# Altium project CT9042.PrjPcb (part 2 of 2)

## Sheet MULTIPLIER.SchDoc
size Tabloid; SheetNumber: 7; SheetTotal: 9
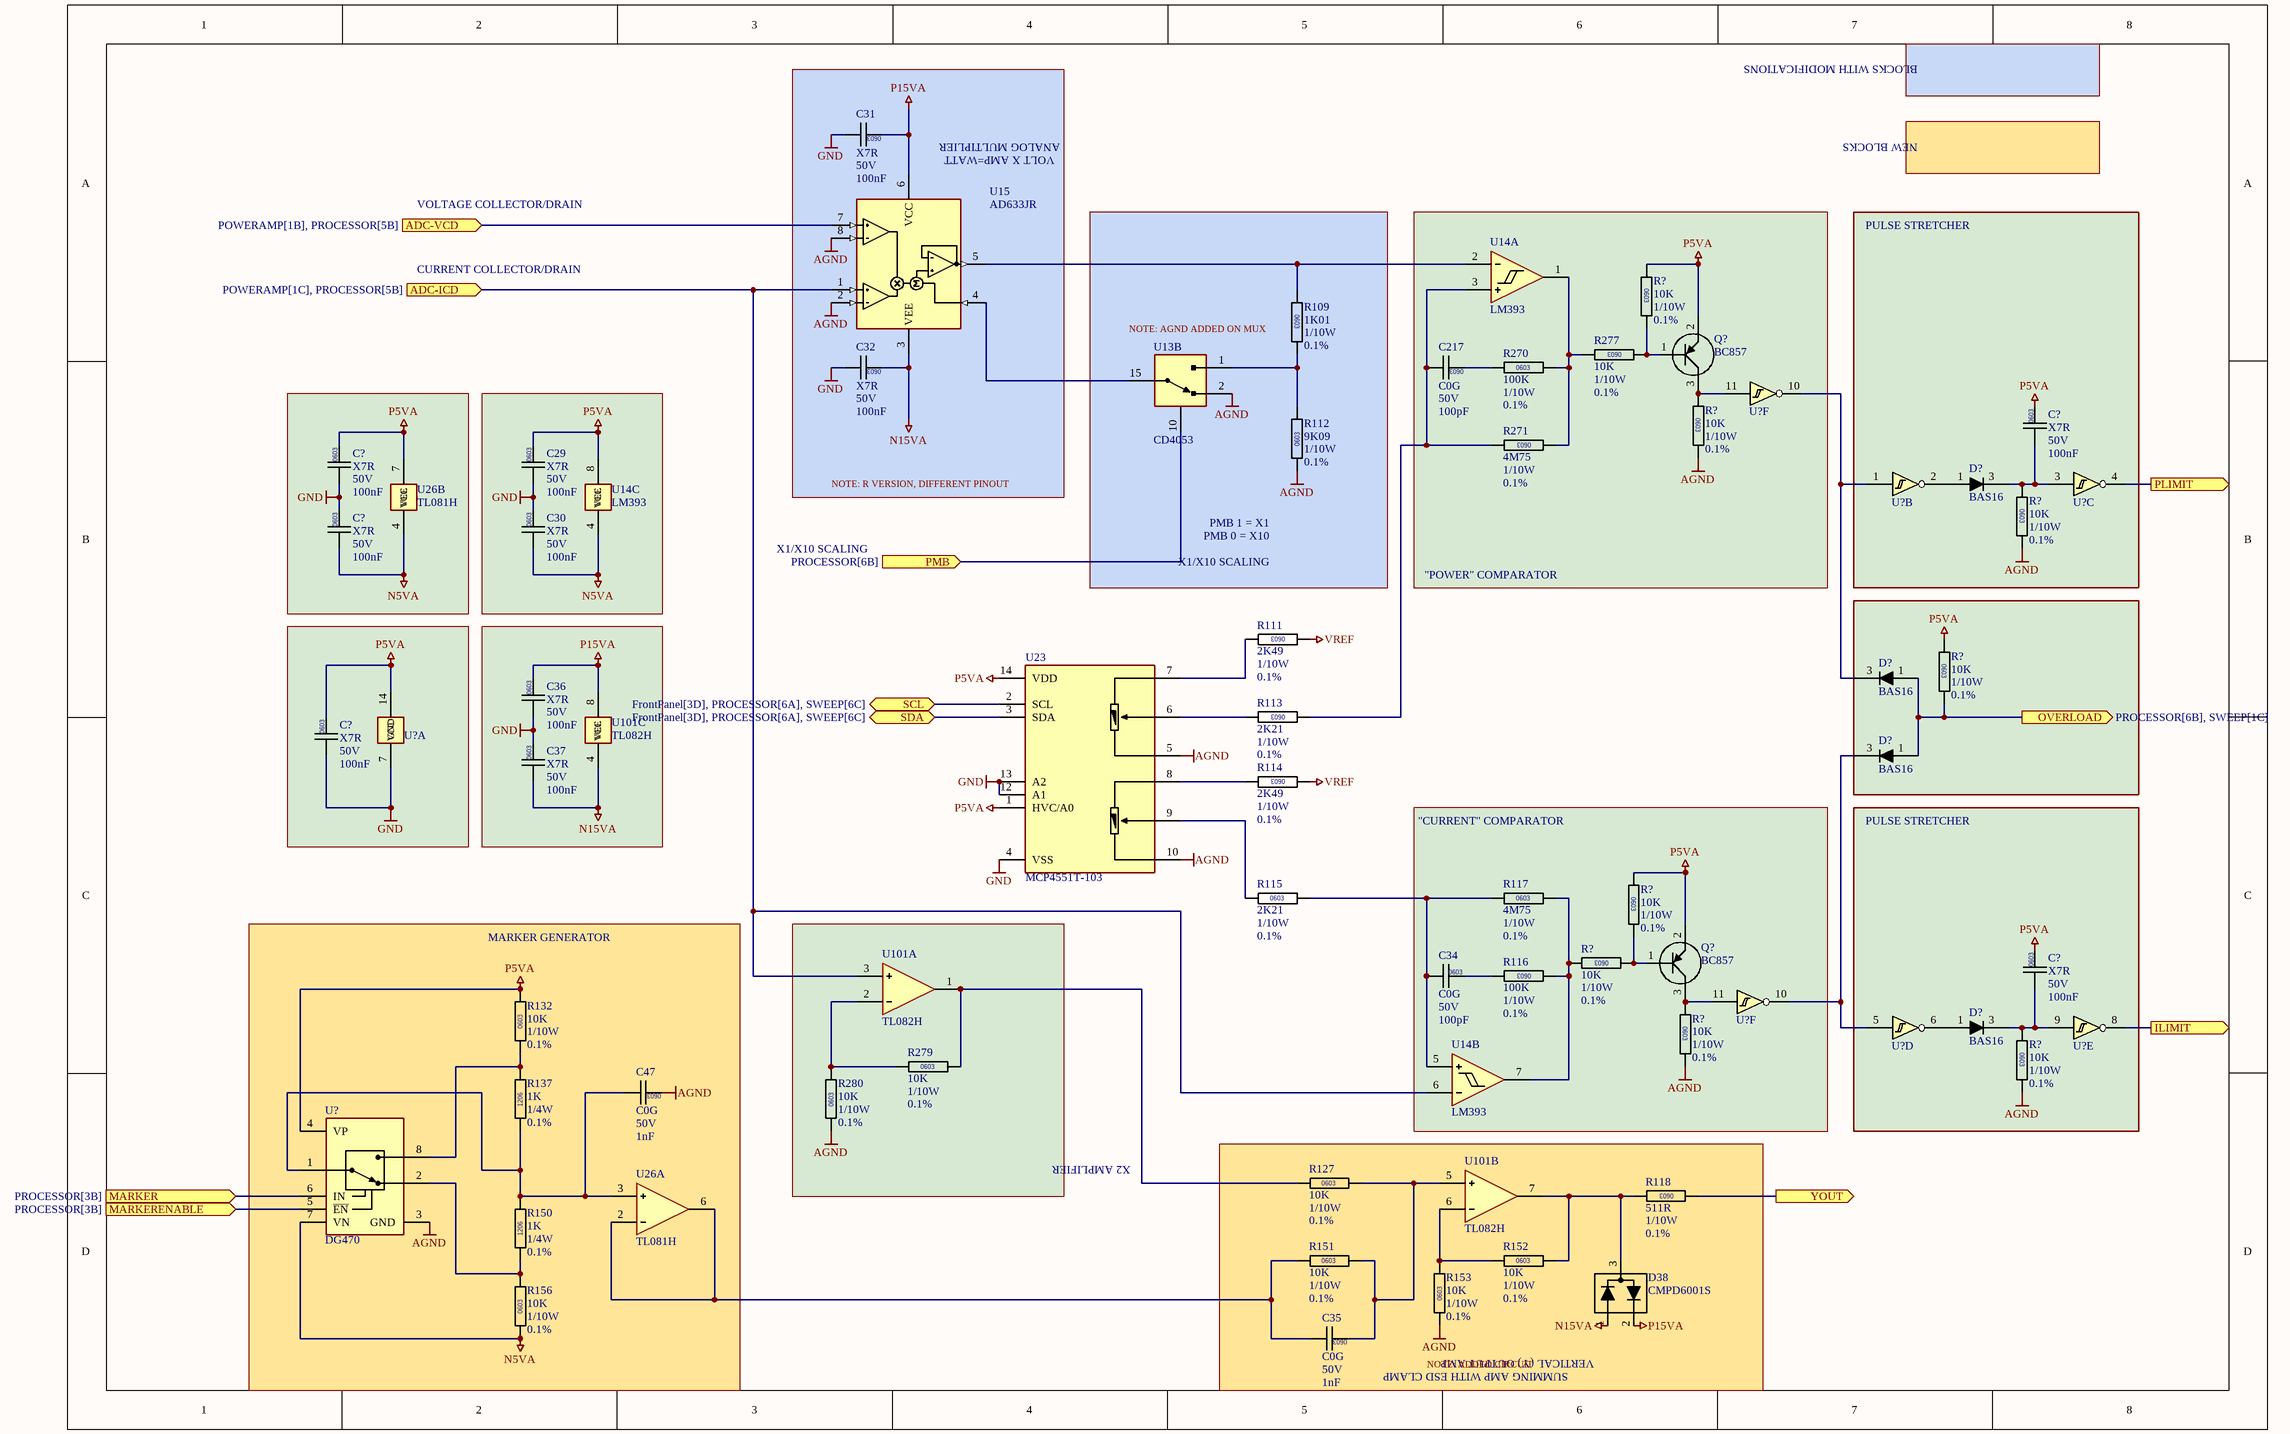
[diagram p5: MULTIPLIER.SchDoc]

### Parts
(Parts that share a designator on the sheet are numbered #1, #2 ... from top to bottom, then left to right.)
C29  Dielectric: X7R  Voltage: 50V  Capacitance: 100nF  [CAPC0603]  (hidden comment: CAP0603)
C30  Dielectric: X7R  Voltage: 50V  Capacitance: 100nF  [CAPC0603]  (hidden comment: CAP0603)
C31  Dielectric: X7R  Voltage: 50V  Capacitance: 100nF  [CAPC0603]  (hidden comment: CAP0603)
C32  Dielectric: X7R  Voltage: 50V  Capacitance: 100nF  [CAPC0603]  (hidden comment: CAP0603)
C34  Dielectric: C0G  Voltage: 50V  Capacitance: 100pF  [CAPC0603]  (hidden comment: CAP0603)
C35  Dielectric: C0G  Voltage: 50V  Capacitance: 1nF  [CAPC0603]  (hidden comment: CAP0603)
C36  Dielectric: X7R  Voltage: 50V  Capacitance: 100nF  [CAPC0603]  (hidden comment: CAP0603)
C37  Dielectric: X7R  Voltage: 50V  Capacitance: 100nF  [CAPC0603]  (hidden comment: CAP0603)
C47  Dielectric: C0G  Voltage: 50V  Capacitance: 1nF  [CAPC0603]  (hidden comment: CAP0603)
C217  Dielectric: C0G  Voltage: 50V  Capacitance: 100pF  [CAPC0603]  (hidden comment: CAP0603)
C?#1  Dielectric: X7R  Voltage: 50V  Capacitance: 100nF  [CAPC0603]  (hidden comment: CAP0603)
C?#2  Dielectric: X7R  Voltage: 50V  Capacitance: 100nF  [CAPC0603]  (hidden comment: CAP0603)
C?#3  Dielectric: X7R  Voltage: 50V  Capacitance: 100nF  [CAPC0603]  (hidden comment: CAP0603)
C?#4  Dielectric: X7R  Voltage: 50V  Capacitance: 100nF  [CAPC0603]  (hidden comment: CAP0603)
C?#5  Dielectric: X7R  Voltage: 50V  Capacitance: 100nF  [CAPC0603]  (hidden comment: CAP0603)
D38  CMPD6001S  [SOT23]
D?#1  BAS16  [SOT23]
D?#2  BAS16  [SOT23]
D?#3  BAS16  [SOT23]
D?#4  BAS16  [SOT23]
Q?#1  BC857  [SOT23]
Q?#2  BC857  [SOT23]
R109  value 1K01  Power: 1/10W  Tolerance: 0.1%  [RESC0603]  (hidden comment: RESC0603)
R111  value 2K49  Power: 1/10W  Tolerance: 0.1%  [RESC0603]  (hidden comment: RESC0603)
R112  value 9K09  Power: 1/10W  Tolerance: 0.1%  [RESC0603]  (hidden comment: RESC0603)
R113  value 2K21  Power: 1/10W  Tolerance: 0.1%  [RESC0603]  (hidden comment: RESC0603)
R114  value 2K49  Power: 1/10W  Tolerance: 0.1%  [RESC0603]  (hidden comment: RESC0603)
R115  value 2K21  Power: 1/10W  Tolerance: 0.1%  [RESC0603]  (hidden comment: RESC0603)
R116  value 100K  Power: 1/10W  Tolerance: 0.1%  [RESC0603]  (hidden comment: RESC0603)
R117  value 4M75  Power: 1/10W  Tolerance: 0.1%  [RESC0603]  (hidden comment: RESC0603)
R118  value 511R  Power: 1/10W  Tolerance: 0.1%  [RESC0603]  (hidden comment: RESC0603)
R127  value 10K  Power: 1/10W  Tolerance: 0.1%  [RESC0603]  (hidden comment: RESC0603)
R132  value 10K  Power: 1/10W  Tolerance: 0.1%  [RESC0603]  (hidden comment: RESC0603)
R137  value 1K  Power: 1/4W  Tolerance: 0.1%  [RESC1206]  (hidden comment: RESC1206)
R150  value 1K  Power: 1/4W  Tolerance: 0.1%  [RESC1206]  (hidden comment: RESC1206)
R151  value 10K  Power: 1/10W  Tolerance: 0.1%  [RESC0603]  (hidden comment: RESC0603)
R152  value 10K  Power: 1/10W  Tolerance: 0.1%  [RESC0603]  (hidden comment: RESC0603)
R153  value 10K  Power: 1/10W  Tolerance: 0.1%  [RESC0603]  (hidden comment: RESC0603)
R156  value 10K  Power: 1/10W  Tolerance: 0.1%  [RESC0603]  (hidden comment: RESC0603)
R270  value 100K  Power: 1/10W  Tolerance: 0.1%  [RESC0603]  (hidden comment: RESC0603)
R271  value 4M75  Power: 1/10W  Tolerance: 0.1%  [RESC0603]  (hidden comment: RESC0603)
R277  value 10K  Power: 1/10W  Tolerance: 0.1%  [RESC0603]  (hidden comment: RESC0603)
R279  value 10K  Power: 1/10W  Tolerance: 0.1%  [RESC0603]  (hidden comment: RESC0603)
R280  value 10K  Power: 1/10W  Tolerance: 0.1%  [RESC0603]  (hidden comment: RESC0603)
R?#1  value 10K  Power: 1/10W  Tolerance: 0.1%  [RESC0603]  (hidden comment: RESC0603)
R?#2  value 10K  Power: 1/10W  Tolerance: 0.1%  [RESC0603]  (hidden comment: RESC0603)
R?#3  value 10K  Power: 1/10W  Tolerance: 0.1%  [RESC0603]  (hidden comment: RESC0603)
R?#4  value 10K  Power: 1/10W  Tolerance: 0.1%  [RESC0603]  (hidden comment: RESC0603)
R?#5  value 10K  Power: 1/10W  Tolerance: 0.1%  [RESC0603]  (hidden comment: RESC0603)
R?#6  value 10K  Power: 1/10W  Tolerance: 0.1%  [RESC0603]  (hidden comment: RESC0603)
R?#7  value 10K  Power: 1/10W  Tolerance: 0.1%  [RESC0603]  (hidden comment: RESC0603)
R?#8  value 10K  Power: 1/10W  Tolerance: 0.1%  [RESC0603]  (hidden comment: RESC0603)
U13  CD4053  [SO127P600-16N]  (part B of 4)
U14  LM393  [SO127P600-8N]  (parts A,B,C of 3)
U15  AD633JR  [SO127P600-8N]
U23  MCP4551T-103
U26  TL081H  [SO127P600-8N]  (parts A,B of 2)
U101  TL082H  [SO127P600-8N]  (parts A,B,C of 3)
U?#1  CD40106  (value not drawn)  (part F of 7)
U?#2  CD40106  (value not drawn)  (part B of 7)
U?#3  CD40106  (value not drawn)  (part C of 7)
U?#4  CD40106  (value not drawn)  (part A of 7)
U?#5  CD40106  (value not drawn)  (part F of 7)
U?#6  CD40106  (value not drawn)  (part D of 7)
U?#7  CD40106  (value not drawn)  (part E of 7)
U?#8  DG470  [SO127P600-8N]

### Blocks framed on the sheet
"POWER" COMPARATOR: C217 Q?#1 R270 R271 R277 R?#1 R?#2 U14 U?#1
PULSE STRETCHER: C?#1 D?#1 R?#3 U?#2 U?#3
"CURRENT" COMPARATOR: C34 Q?#2 R116 R117 R?#5-R?#7 U14 U?#5
PULSE STRETCHER: C?#5 D?#4 R?#8 U?#6 U?#7
MARKER GENERATOR: C47 R132 R137 R150 R156 U26 U?#8
X2 AMPLIFIER: R279 R280 U101

### Ports
ADC-ICD (in, see POWERAMP[1C], PROCESSOR[5B]), ADC-VCD (in, see POWERAMP[1B], PROCESSOR[5B]), ILIMIT (out), MARKER (in, see PROCESSOR[3B]), MARKERENABLE (in, see PROCESSOR[3B]), OVERLOAD (out, see PROCESSOR[6B], SWEEP[1C]), PLIMIT (out), PMB (in, see PROCESSOR[6B]), SCL (bidir, see FrontPanel[3D], PROCESSOR[6A], SWEEP[6C]), SDA (bidir, see FrontPanel[3D], PROCESSOR[6A], SWEEP[6C]), YOUT (out)

### Nets
AGND: C47.1 R112.2 R153.2 R280.2 R?#2.1 R?#3.1 R?#7.1 R?#8.1 U13.2(Y2) U15.2(YN) U15.8(X1N) U23.5(POA) U23.10(POB) U?#8.3(GND)
GND: C29.2 C30.1 C31.2 C32.2 C36.2 C37.1 C?#2.2 C?#3.1 C?#4.2 U23.4(VSS) U23.12(A1) U23.13(A2) U?#4.7(GND)
N5VA: C30.2 C?#3.2 R156.2 U14.4(VEE) U26.4(VEE) U?#8.7(VN)
N15VA: C32.1 C37.2 D38.1(K) U15.3(VEE) U101.4(VEE)
P5VA: C29.1 C?#1.1 C?#2.1 C?#4.1 C?#5.1 Q?#1.2(E) Q?#2.2(E) R132.1 R?#1.2 R?#4.2 R?#5.2 U14.8(VCC) U23.1(HVC/A0) U23.14(VDD) U26.7(VCC) U?#4.14(VCC) U?#8.4(VP)
P15VA: C31.1 C36.1 D38.2(A) U15.6(VCC) U101.8(VCC)
VREF: R111.2 R114.2
ADC-ICD: U14.6(-) U15.1(YP) U101.3(+) ; port ADC-ICD
ADC-VCD: U15.7(X1P) ; port ADC-VCD
ILIMIT: U?#7.8 ; port ILIMIT
MARKER: U?#8.6(IN) ; port MARKER
MARKERENABLE: U?#8.5(~{EN}) ; port MARKERENABLE
OVERLOAD: D?#2.1(A) D?#3.1(A) R?#4.1 ; port OVERLOAD
PLIMIT: U?#3.4 ; port PLIMIT
PMB: U13.10(A) ; port PMB
SCL: U23.2(SCL) ; port SCL
SDA: U23.3(SDA) ; port SDA
YOUT: R118.2 ; port YOUT
NetC34_1: C34.1 R116.2
NetC34_2: C34.2 R115.1 R117.2 U14.5(+)
NetC35_1: C35.1 R127.1 R151.1 U101.5(+)
NetC35_2: C35.2 R151.2 U26.2(-) U26.6(O)
NetC47_2: C47.2 R137.2 R150.1 U26.3(+) U?#8.1(COM)
NetC217_1: C217.1 R270.2
NetC217_2: C217.2 R113.2 R271.2 U14.3(+)
NetC?#1_2: C?#1.2 D?#1.3(K) R?#3.2 U?#3.3
NetC?#5_2: C?#5.2 D?#4.3(K) R?#8.2 U?#7.9
NetD38_3: D38.3(A) R118.1 R152.1 U101.7(O)
NetD?#1_1: D?#1.1(A) U?#2.2
NetD?#2_3: D?#2.3(K) U?#1.10 U?#2.1
NetD?#3_3: D?#3.3(K) U?#5.10 U?#6.5
NetD?#4_1: D?#4.1(A) U?#6.6
NetQ?#1_1: Q?#1.1(B) R277.2 R?#1.1
NetQ?#1_3: Q?#1.3(C) R?#2.2 U?#1.11
NetQ?#2_1: Q?#2.1(B) R?#5.1 R?#6.2
NetQ?#2_3: Q?#2.3(C) R?#7.2 U?#5.11
NetR109_1: R109.1 R112.1 U13.1(Y0)
NetR109_2: R109.2 U14.2(-) U15.5(W)
NetR111_1: R111.1 U23.7(POB)
NetR113_1: R113.1 U23.6(OW)
NetR114_1: R114.1 U23.8(POA)
NetR115_2: R115.2 U23.9(OW)
NetR116_1: R116.1 R117.1 R?#6.1 U14.7(O)
NetR127_2: R127.2 R279.1 U101.1(O)
NetR132_2: R132.2 R137.1 U?#8.8(NO)
NetR150_2: R150.2 R156.1 U?#8.2(COM)
NetR152_2: R152.2 R153.1 U101.6(-)
NetR270_1: R270.1 R271.1 R277.1 U14.1(O)
NetR279_2: R279.2 R280.1 U101.2(-)
NetU13_15: U13.15(X2) U15.4(Z)

### Notes on the sheet
- BLOCKS WITH MODIFICATIONS
- (near U15) ANALOG MULTIPLIER
- (near U15) VOLT X AMP=WATT
- NEW BLOCKS
- VOLTAGE COLLECTOR/DRAIN
- CURRENT COLLECTOR/DRAIN
- (near U13) NOTE: AGND ADDED ON MUX
- NOTE: R VERSION, DIFFERENT PINOUT
- X1/X10 SCALING
- PMB 0 = X10
- PMB 1 = X1
- (near R153) NOTE: ADDED CIRCUIT
- SUMMING AMP WITH ESD CLAMP
- (near D38) VERTICAL (Y) OUTPUT AMP
- (in symbol RESC-0603-1K01-0.1%-1/10W) 0603
- (in symbol RESC-0603-2K21-0.1%-1/10W) 0603
- (in symbol RESC-0603-2K49-0.1%-1/10W) 0603
- (in symbol RESC-0603-4M75-1%-1/10W) 0603
- (in symbol RESC-0603-9K09-0.1%-1/10W) 0603
- (in symbol RESC-0603-10K-0.1%-1/10W) 0603
- (in symbol RESC-0603-100K-0.1%-1/10W) 0603
- (in symbol RESC-0603-511R-0.1%) 0603
- (in symbol RESC-1206-1K-0.1%-1/4W) 1206

### Library data of the parts
C29-C32 C36 C37 C?#1-C?#5 = CAPC-0603-100nF-50V-X7R: CAPACITOR,CERAMIC,100nF,50V,X7R,0603; Manufacturer 1: KEMET; Manufacturer Part Number 1: C0603C104K5RACTU; Package / Case: 0603; Location: *; Supplier 1: Mouser; Supplier Part Number 1: 80-C0603C104K5R7867; Supplier 2: Mouser; Supplier Part Number 2: 80-C0603C104K5R7411; Supplier 3: Avnet; Supplier Part Number 3: KGM15BR71H104KT; Supplier 4: Digikey; Supplier Part Number 4: 1276-1000-1-ND; LCSC: C127833; MOUSER: 80-C0603C104K5R
C34 C217 = CAPC-0603-100pF-50V-C0G: CAPACITOR,CERAMIC,100pF,50V,C0G,0603; Package / Case: 0603; Location: *
C35 C47 = CAPC-0603-1nF-20V-C0G: CAPACITOR,CERAMIC,1nF,50V,C0G,0603; Package / Case: 0603; Location: *
D38 = DIODE-CENTRALSEMI-CMPD6001S: DIODE,75V,250mA,SOT23,500pA ULTRA LOW LEAKAGE; Manufacturer 1: CENTRAL SEMICONDUCTOR; Manufacturer Part Number 1: CMPD6001S
D?#1-D?#4 = DIODE-RECTIFIER-DIODES-BAS16-SOT23: DIODE,RECTIFIER,75V,0.3A,BAS16,SOT23; Manufacturer 1: ONSEMI; Manufacturer Part Number 1: BAS16LT1G; DIGIKEY: BAS16LT1GOSCT-ND
Q?#1 Q?#2 = XSTR-PNP-BC857: XSTR,PNP,SOT23,BC857,SOT23; Manufacturer 1: NEXPERIA; Manufacturer Part Number 1: BC857BW,115; DIGIKEY: 1727-4869-1-ND
R109 = RESC-0603-1K01-0.1%-1/10W: RESISTOR,1K01,0.1%,100mW,0603 (1608); Location: *
R111 R114 = RESC-0603-2K49-0.1%-1/10W: RESISTOR,2K49,0.1%,100mW,0603 (1608); Location: *
R112 = RESC-0603-9K09-0.1%-1/10W: RESISTOR,9K09,0.1%,100mW,0603 (1608); Location: *
R113 R115 = RESC-0603-2K21-0.1%-1/10W: RESISTOR,2K21,0.1%,100mW,0603 (1608); Location: *
R116 R270 = RESC-0603-100K-0.1%-1/10W: RESISTOR,100K,0.1%,100mW,0603 (1608); Location: *
R117 R271 = RESC-0603-4M75-1%-1/10W: RESISTOR,4M75,0.1%,100mW,0603 (1608); Location: *
R118 = RESC-0603-511R-0.1%: RESISTOR,511R,0.1%,100mW,0603 (1608); Location: *
R127 R132 R151-R153 R156 R277 R279 R280 R?#1-R?#8 = RESC-0603-10K-0.1%-1/10W: RESISTOR,10K,0.1%,100mW,0603 (1608); Location: *
R137 R150 = RESC-1206-1K-0.1%-1/4W: RESISTOR,1K,1206,0.1%,125mW,1206; Location: *; Parameter 4: *
U13 = IC-TI-CD4053-SPLIT: IC,LOGIC,CMOS,4XXX,TRIPLE 2:1 MUX,SPLIT BLOCKS
U14 = IC-TI-LM393-SO8: IC,COMPARATOR,DUAL,LM393,SO8; Manufacturer 1: DIODES-INC; Manufacturer Part Number 1: AS393AMTR-E1; DIGIKEY: AS393AMTR-E1
U15 = IC-ANALOG-AD633XR-SO8: IC,ANALOG,MULTIPLIER,ANALOGDEVICES,AD633JRZ,SO8; DIGIKEY: 505-AD633JRZ-ND; Manufacturer 1: ANALOG DEVICES; Manufacturer Part Number 1: AD633JRZ
U23 = IC-MICROCHIP-MCP4651T-103: IC,DIGITAL POTMETER,257STEP,I2C,10K,MICROCHIP,MCP4551T-103
U26 = IC-TI-TL081-SO8: IC,OPAMP JFET,SINGLE,TL081HIDR,SO8; Manufacturer 1: TI; Manufacturer Part Number 1: TL081HIDR; MOUSER: 595-TL081HIDR
U101 = IC-TI-TL082H-SO8: IC,OPAMP JFET,DUAL,TL082HIDR,SO8; Manufacturer 1: TI; Manufacturer Part Number 1: TL082HIDR; MOUSER: 595-TL082HIDR
U?#1-U?#7 = IC-TI-CD40106-SO14: IC,LOGIC,CMOS.4XXX,HEX SCHMITTTRIGGER,CD40106,SO14; Manufacturer 1: ONSEMI; Manufacturer Part Number 1: MC74AC14DR2G; DIGIKEY: MC74AC14DR2GOSCT-ND
U?#8 = IC-SILICONIX-DG470EY-T1-E3-SO8: IC,ANALOG,SPDT ANALOG SWITCH,SILICONIX,DG470EY-T1-E3,SO8; Manufacturer 1: VSHIAY; DIGIKEY: DG470EY-T1-E3CT-ND; Manufacturer Part Number 1: DG470EY-T1-E3

## Sheet POWERMUX.SchDoc
size Tabloid; SheetNumber: 8; SheetTotal: 9
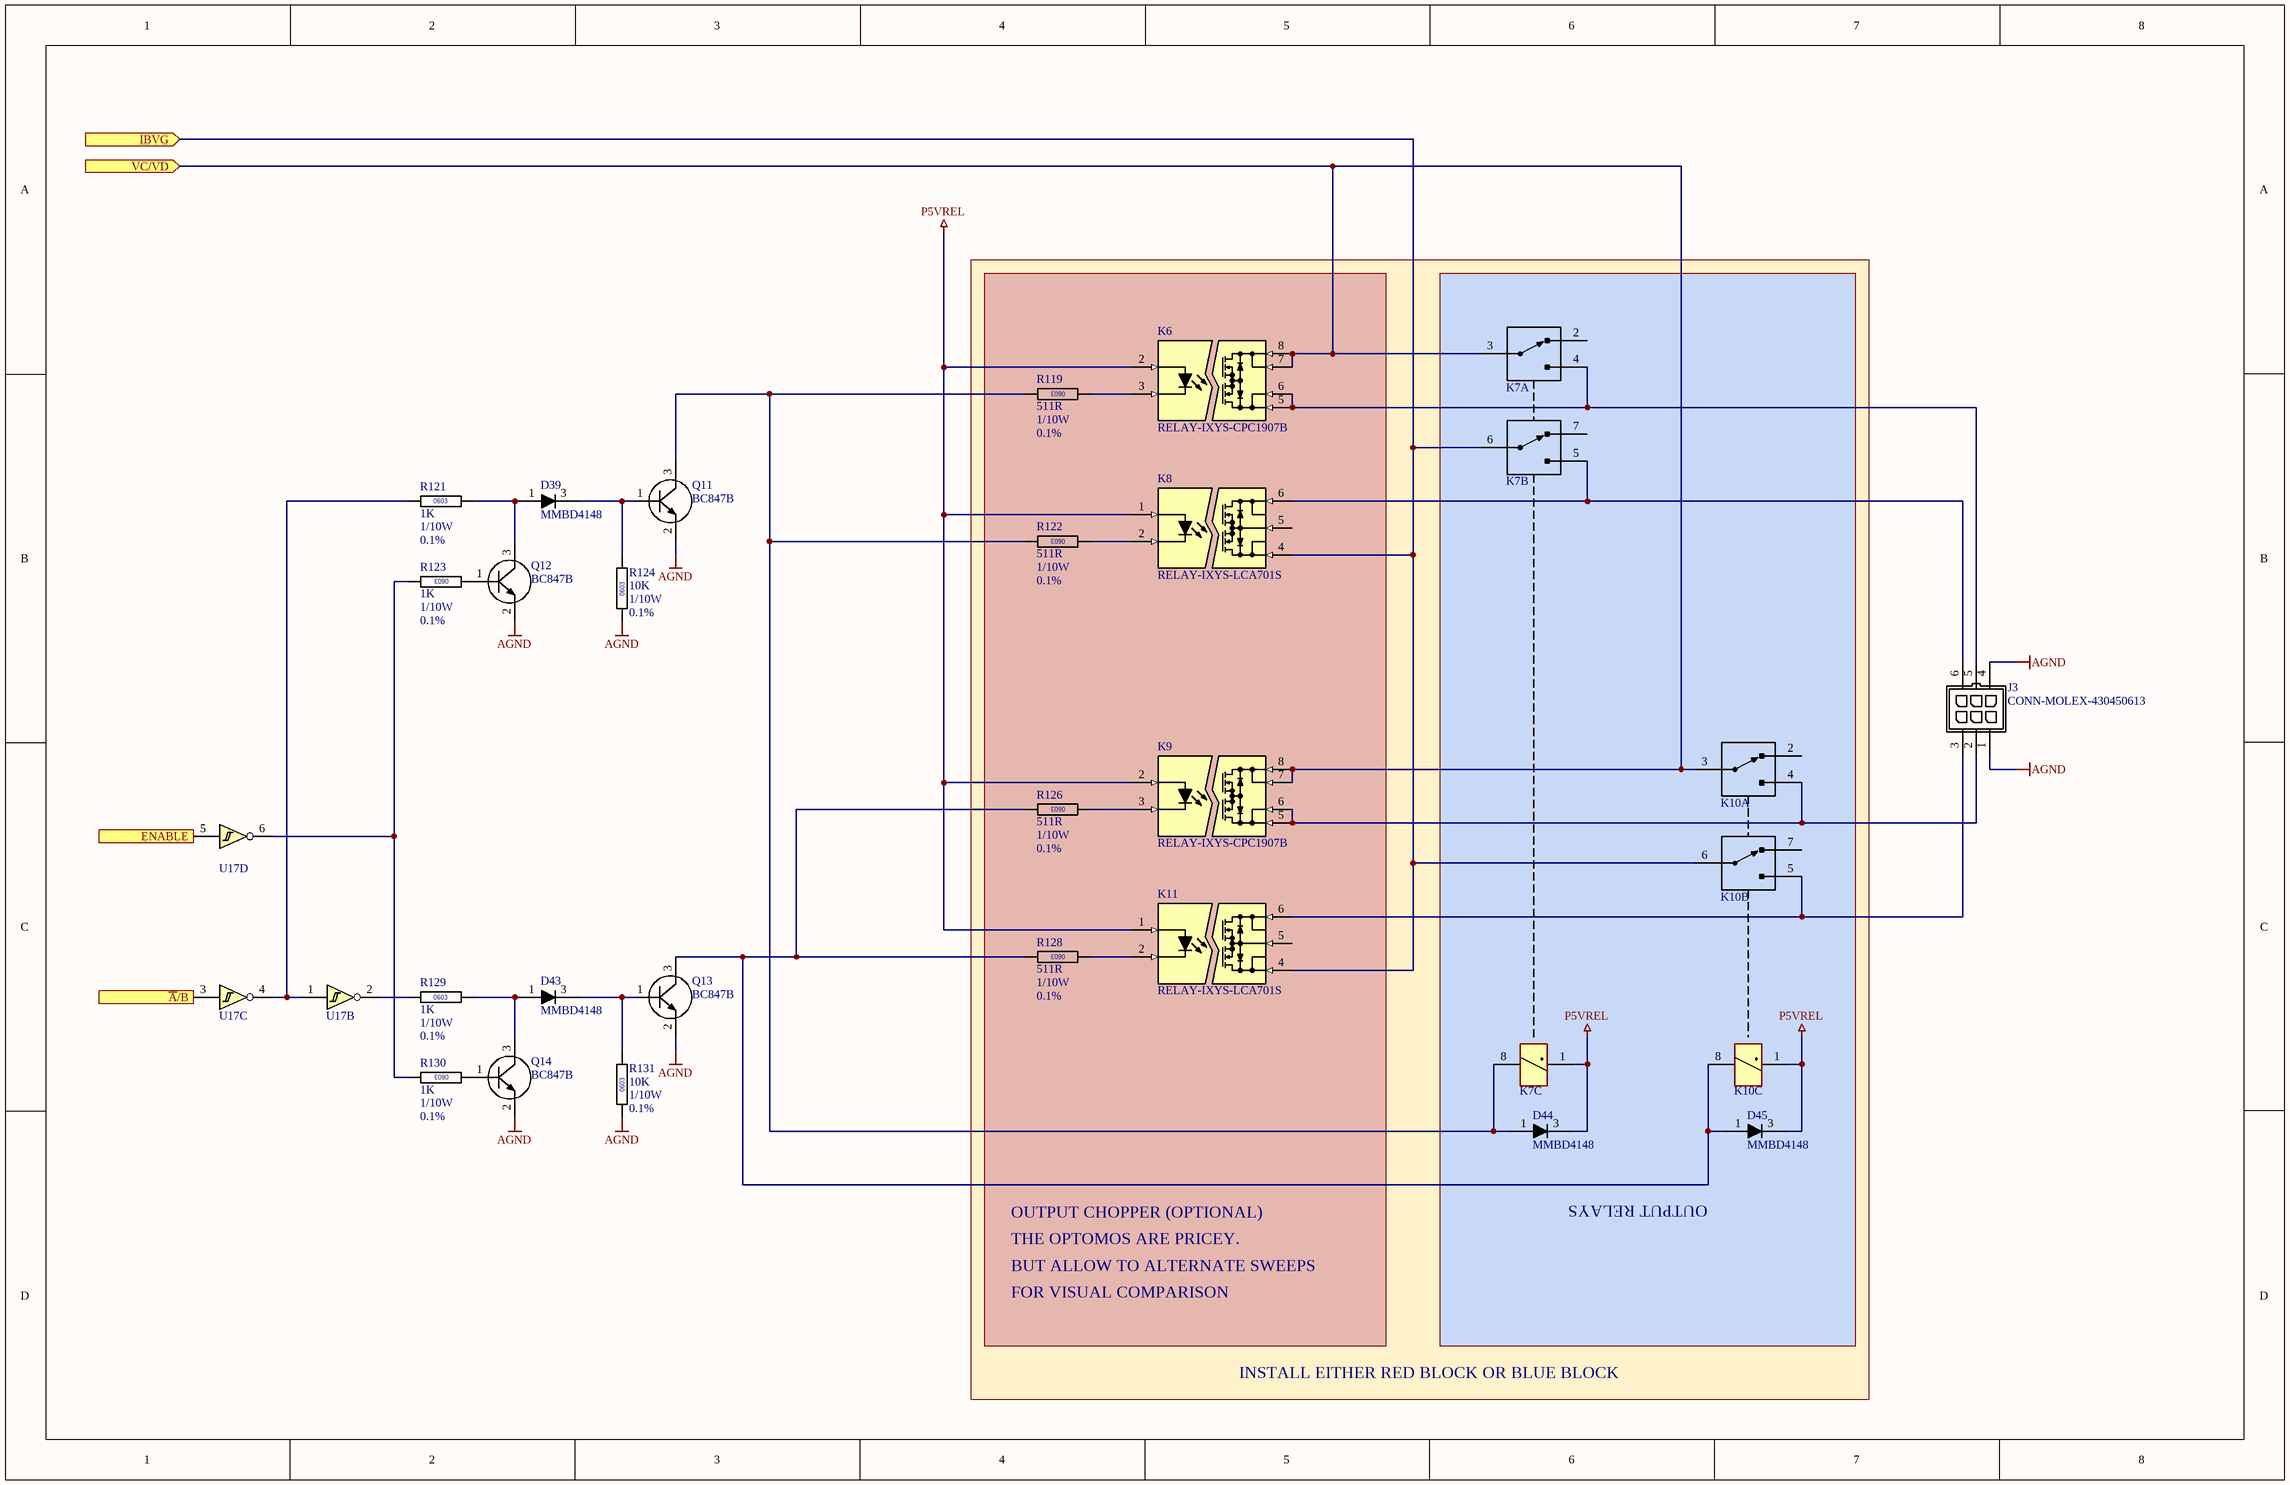
[diagram p6: POWERMUX.SchDoc]

### Parts
D39  MMBD4148
D43  MMBD4148
D44  MMBD4148
D45  MMBD4148
J3  CONN-MOLEX-430450613  [CONN-MOLEX-430450613]
K6  RELAY-IXYS-CPC1907B  [SO508P1676-8N]
K7  RELAY-KEMET-UA2-5NJ  [RELAY-KEMET-UA2-5NJ]  (value not drawn)  (parts A,B,C of 3)
K8  RELAY-IXYS-LCA701S  [SO254P960-6N]
K9  RELAY-IXYS-CPC1907B  [SO508P1676-8N]
K10  RELAY-KEMET-UA2-5NJ  [RELAY-KEMET-UA2-5NJ]  (value not drawn)  (parts A,B,C of 3)
K11  RELAY-IXYS-LCA701S  [SO254P960-6N]
Q11  BC847B  [SOT23]
Q12  BC847B  [SOT23]
Q13  BC847B  [SOT23]
Q14  BC847B  [SOT23]
R119  value 511R  Power: 1/10W  Tolerance: 0.1%  [RESC0603]  (hidden comment: RESC0603)
R121  value 1K  Power: 1/10W  Tolerance: 0.1%  [RESC0603]  (hidden comment: RESC0603)
R122  value 511R  Power: 1/10W  Tolerance: 0.1%  [RESC0603]  (hidden comment: RESC0603)
R123  value 1K  Power: 1/10W  Tolerance: 0.1%  [RESC0603]  (hidden comment: RESC0603)
R124  value 10K  Power: 1/10W  Tolerance: 0.1%  [RESC0603]  (hidden comment: RESC0603)
R126  value 511R  Power: 1/10W  Tolerance: 0.1%  [RESC0603]  (hidden comment: RESC0603)
R128  value 511R  Power: 1/10W  Tolerance: 0.1%  [RESC0603]  (hidden comment: RESC0603)
R129  value 1K  Power: 1/10W  Tolerance: 0.1%  [RESC0603]  (hidden comment: RESC0603)
R130  value 1K  Power: 1/10W  Tolerance: 0.1%  [RESC0603]  (hidden comment: RESC0603)
R131  value 10K  Power: 1/10W  Tolerance: 0.1%  [RESC0603]  (hidden comment: RESC0603)
U17  IC-TI-74HC14  [SOT23-6]  (value not drawn)  (parts B,C,D of 7)

### Blocks framed on the sheet
OUTPUT RELAYS: D44 D45 K7 K10

### Ports
ENABLE (in), IBVG (in), VC/VD (in), ~{A}/B (in)

### Nets
AGND: J3.1 J3.4 Q11.2(E) Q12.2(E) Q13.2(E) Q14.2(E) R124.2 R131.2
P5VREL: D44.3(K) D45.3(K) K6.2 K7.1 K8.1 K9.2 K10.1 K11.1
~{A}/B: U17.3 ; port ~{A}/B
ENABLE: U17.5 ; port ENABLE
IBVG: K7.6(COM) K8.4 K10.6(COM) K11.4 ; port IBVG
VC/VD: K6.7 K6.8 K7.3(COM) K9.7 K9.8 K10.3(COM) ; port VC/VD
NetD39_1: D39.1(A) Q12.3(C) R121.1
NetD39_3: D39.3(K) Q11.1(B) R124.1
NetD43_1: D43.1(A) Q14.3(C) R129.1
NetD43_3: D43.3(K) Q13.1(B) R131.1
NetD44_1: D44.1(A) K7.8 Q11.3(C) R119.1 R122.1
NetD45_1: D45.1(A) K10.8 Q13.3(C) R126.1 R128.1
NetJ3_2: J3.2 K9.5 K9.6 K10.4(NO)
NetJ3_3: J3.3 K10.5(NO) K11.6
NetJ3_5: J3.5 K6.5 K6.6 K7.4(NO)
NetJ3_6: J3.6 K7.5(NO) K8.6
NetK6_3: K6.3 R119.2
NetK8_2: K8.2 R122.2
NetK9_3: K9.3 R126.2
NetK11_2: K11.2 R128.2
NetQ12_1: Q12.1(B) R123.2
NetQ14_1: Q14.1(B) R130.2
NetR121_2: R121.2 U17.1 U17.4
NetR123_1: R123.1 R130.1 U17.6
NetR129_2: R129.2 U17.2

Not connected (* = marked no-connect by the designer): K7 2(NC) 7(NC); K8 5; K10 2(NC) 7(NC); K11 5

### Notes on the sheet
- OUTPUT CHOPPER (OPTIONAL)
- THE OPTOMOS ARE PRICEY.
- BUT ALLOW TO ALTERNATE SWEEPS
- FOR VISUAL COMPARISON
- INSTALL EITHER RED BLOCK OR BLUE BLOCK
- (in symbol RESC-0603-1K-0.1%-1/10W) 0603
- (in symbol RESC-0603-10K-0.1%-1/10W) 0603
- (in symbol RESC-0603-511R-0.1%-1/10W) 0603

### Library data of the parts
D39 D43-D45 = DIODE-RECTIFIER-DIODES-MMBD4148-SOT23: DIODE,RECTIFIER,75V,0.3A,MMBD4148,SOT23; Manufacturer 1: DIODES; Manufacturer Part Number 1: MMBD4148
J3 = CONN-MOLEX-430450613: CONN,2X3,MOLEX MICROFIT,TH,VERT
K6 K9 = RELAY-IXYS-CPC1907B: RELAY,OPTOMOS,6A,60V,AC,IXYS,CPC1907B,SMD
K7 K10 = RELAY-KEMET-UA2-5NJ: RELAY,DPDT,1A,250VAC,220VDC,5V COIL,KEMET,UA2-5NJ; DIGIKEY: 399-UA2-5NJ-ND; Manufacturer 1: KEMET; Manufacturer Part Number 1: UA2-5NJ
K8 K11 = RELAY-IXYS-LCA701S: RELAY,OPTOMOS,1.5A,100V,AC,IXYS,LCA701S,SMD
Q11-Q14 = XSTR-NPN-BC847: XSTR,NPN,45V,0.1A,,BC847B,SOT23
R119 R122 R126 R128 = RESC-0603-511R-0.1%-1/10W: RESISTOR,511R,0.1%,100mW,0603 (1608); Location: *
R121 R123 R129 R130 = RESC-0603-1K-0.1%-1/10W: RESISTOR,1K,0.1%,100mW,0603 (1608); Location: *
R124 R131 = RESC-0603-10K-0.1%-1/10W: RESISTOR,10K,0.1%,100mW,0603 (1608); Location: *
U17 = IC-TI-74HC14-SO14: IC,NOT,HEX,SCHMITTTRIGGER,ONSEMI,MC74AC14DR2G,SO14; DIGIKEY: MC74AC14DR2GOSCT-ND; Manufacturer 1: ONSEMI; Manufacturer Part Number 1: MC74AC14DR2G

## Sheet FrontPanel.SchDoc
size A2; SheetNumber: 2; SheetTotal: 9
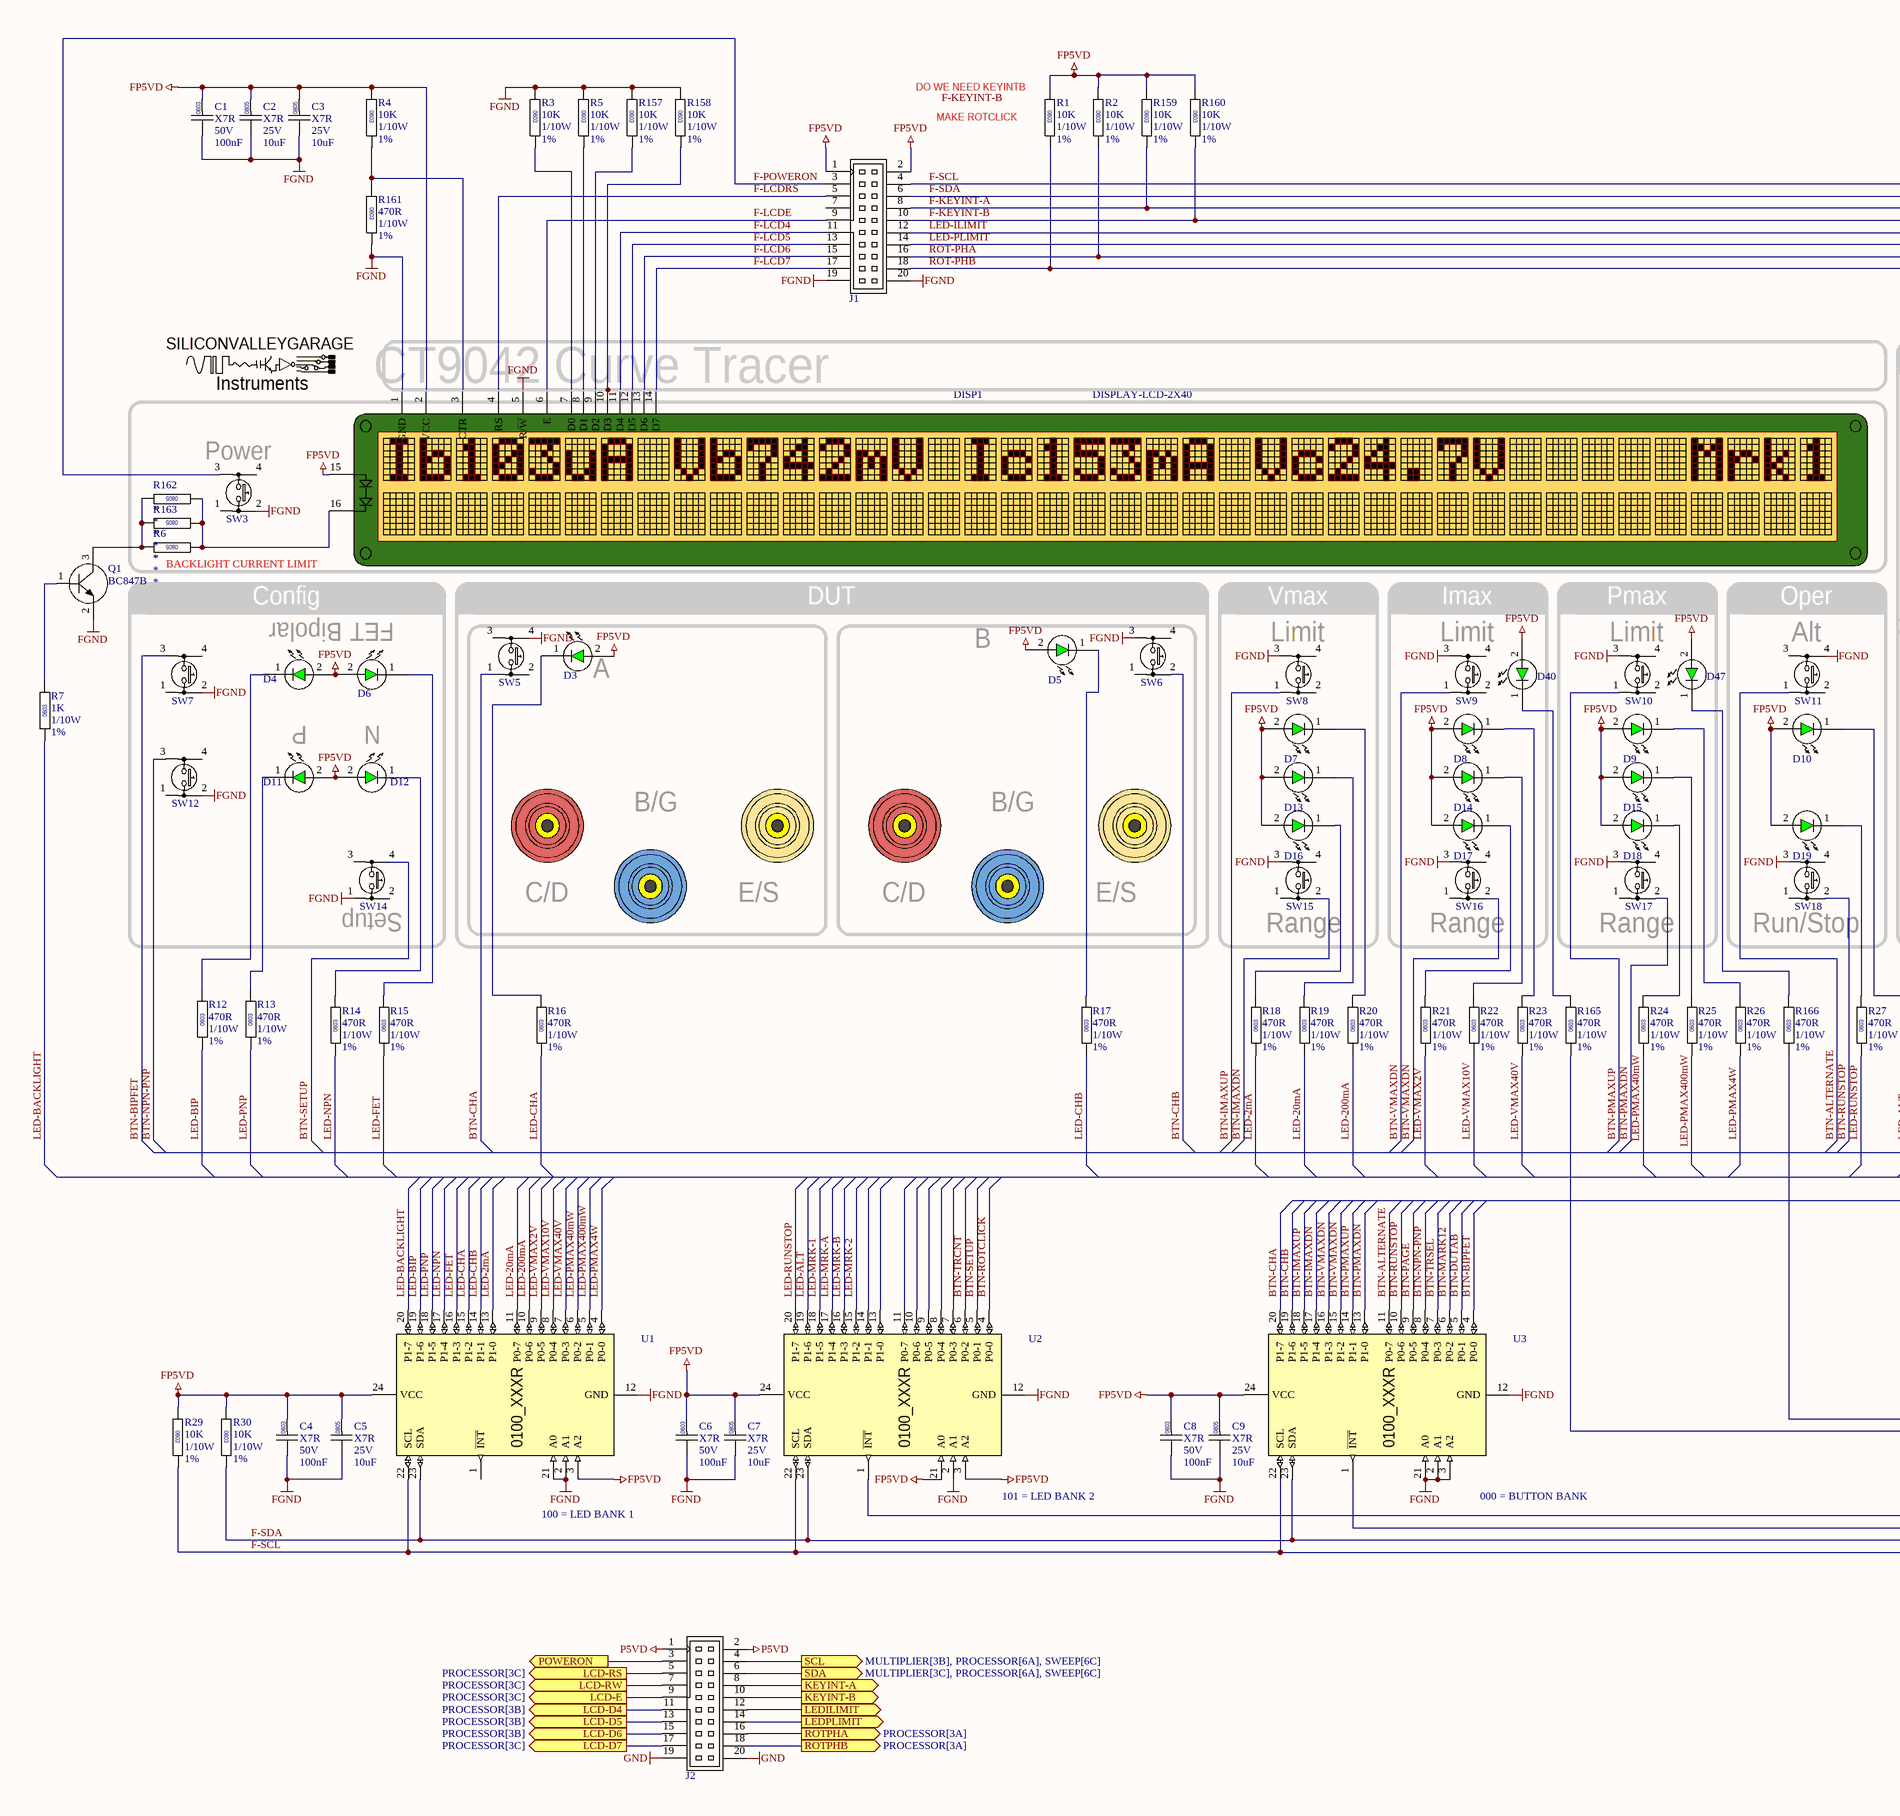
[diagram p7: FrontPanel.SchDoc, left]
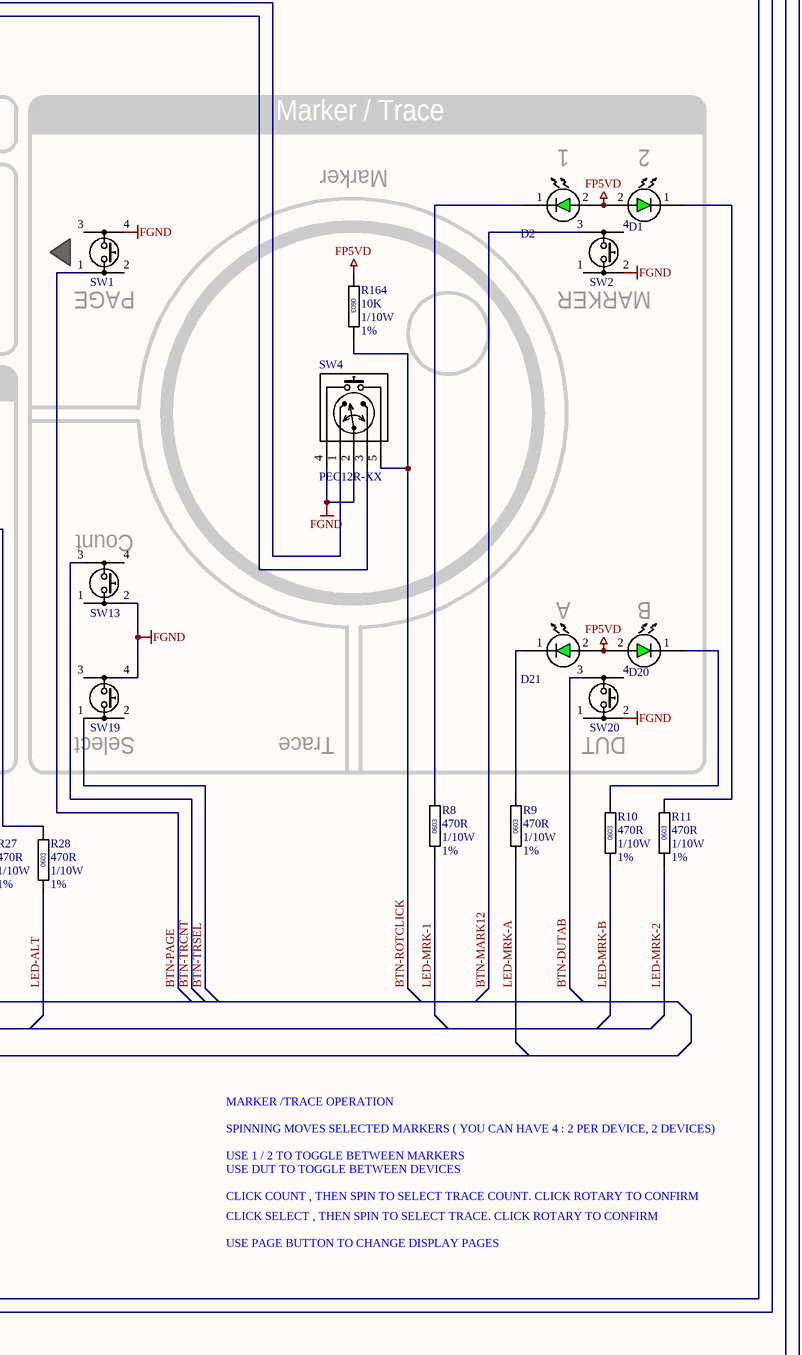
[diagram p8: FrontPanel.SchDoc, right]

### Parts
(Parts that share a designator on the sheet are numbered #1, #2 ... from top to bottom, then left to right.)
C1  Dielectric: X7R  Voltage: 50V  Capacitance: 100nF  [CAPC0603]  (hidden comment: CAP0603)
C2  Dielectric: X7R  Voltage: 25V  Capacitance: 10uF  [CAPC0805]  (hidden comment: CAP0805)
C3  Dielectric: X7R  Voltage: 25V  Capacitance: 10uF  [CAPC0805]  (hidden comment: CAP0805)
C4  Dielectric: X7R  Voltage: 50V  Capacitance: 100nF  [CAPC0603]  (hidden comment: CAP0603)
C5  Dielectric: X7R  Voltage: 25V  Capacitance: 10uF  [CAPC0805]  (hidden comment: CAP0805)
C6  Dielectric: X7R  Voltage: 50V  Capacitance: 100nF  [CAPC0603]  (hidden comment: CAP0603)
C7  Dielectric: X7R  Voltage: 25V  Capacitance: 10uF  [CAPC0805]  (hidden comment: CAP0805)
C8  Dielectric: X7R  Voltage: 50V  Capacitance: 100nF  [CAPC0603]  (hidden comment: CAP0603)
C9  Dielectric: X7R  Voltage: 25V  Capacitance: 10uF  [CAPC0805]  (hidden comment: CAP0805)
D1  LED-3MM-GREEN  [LED-3MM-GREEN]  (value not drawn)
D2  LED-3MM-GREEN  [LED-3MM-GREEN]  (value not drawn)
D3  LED-3MM-GREEN  [LED-3MM-GREEN]  (value not drawn)
D4  LED-3MM-GREEN  [LED-3MM-GREEN]  (value not drawn)
D5  LED-3MM-GREEN  [LED-3MM-GREEN]  (value not drawn)
D6  LED-3MM-GREEN  [LED-3MM-GREEN]  (value not drawn)
D7  LED-3MM-GREEN  [LED-3MM-GREEN]  (value not drawn)
D8  LED-3MM-GREEN  [LED-3MM-GREEN]  (value not drawn)
D9  LED-3MM-GREEN  [LED-3MM-GREEN]  (value not drawn)
D10  LED-3MM-GREEN  [LED-3MM-GREEN]  (value not drawn)
D11  LED-3MM-GREEN  [LED-3MM-GREEN]  (value not drawn)
D12  LED-3MM-GREEN  [LED-3MM-GREEN]  (value not drawn)
D13  LED-3MM-GREEN  [LED-3MM-GREEN]  (value not drawn)
D14  LED-3MM-GREEN  [LED-3MM-GREEN]  (value not drawn)
D15  LED-3MM-GREEN  [LED-3MM-GREEN]  (value not drawn)
D16  LED-3MM-GREEN  [LED-3MM-GREEN]  (value not drawn)
D17  LED-3MM-GREEN  [LED-3MM-GREEN]  (value not drawn)
D18  LED-3MM-GREEN  [LED-3MM-GREEN]  (value not drawn)
D19  LED-3MM-GREEN  [LED-3MM-GREEN]  (value not drawn)
D20  LED-3MM-GREEN  [LED-3MM-GREEN]  (value not drawn)
D21  LED-3MM-GREEN  [LED-3MM-GREEN]  (value not drawn)
D40  LED-3MM-GREEN  [LED-3MM-GREEN]  (value not drawn)
D47  LED-3MM-GREEN  [LED-3MM-GREEN]  (value not drawn)
DISP1  DISPLAY-LCD-2X40  [CONNECTOR-GENERIC-PINHEADER-2X8]
J1  BOXHEADER-10X2  [CONNECTOR GENERIC-BOXHEADER-2X10]  (value not drawn)
J2  BOXHEADER-10X2  [CONNECTOR GENERIC-BOXHEADER-2X10]  (value not drawn)
LOGO?#2  LOGO-SILICONVALLEYGARAGE-SMALL  [SILICONVALLEYGARAGE]  (value not drawn)  (graphical)
Q1  BC847B  [SOT23]
R1  value 10K  Power: 1/10W  Tolerance: 1%  [RESC0603]  (hidden comment: RESC0603)
R2  value 10K  Power: 1/10W  Tolerance: 1%  [RESC0603]  (hidden comment: RESC0603)
R3  value 10K  Power: 1/10W  Tolerance: 1%  [RESC0603]  (hidden comment: RESC0603)
R4  value 10K  Power: 1/10W  Tolerance: 1%  [RESC0603]  (hidden comment: RESC0603)
R5  value 10K  Power: 1/10W  Tolerance: 1%  [RESC0603]  (hidden comment: RESC0603)
R6  RESC0805  [RESC0805]  (value not drawn)
R7  value 1K  Power: 1/10W  Tolerance: 1%  [RESC0603]  (hidden comment: RESC0603)
R8  value 470R  Power: 1/10W  Tolerance: 1%  [RESC0603]  (hidden comment: RESC0603)
R9  value 470R  Power: 1/10W  Tolerance: 1%  [RESC0603]  (hidden comment: RESC0603)
R10  value 470R  Power: 1/10W  Tolerance: 1%  [RESC0603]  (hidden comment: RESC0603)
R11  value 470R  Power: 1/10W  Tolerance: 1%  [RESC0603]  (hidden comment: RESC0603)
R12  value 470R  Power: 1/10W  Tolerance: 1%  [RESC0603]  (hidden comment: RESC0603)
R13  value 470R  Power: 1/10W  Tolerance: 1%  [RESC0603]  (hidden comment: RESC0603)
R14  value 470R  Power: 1/10W  Tolerance: 1%  [RESC0603]  (hidden comment: RESC0603)
R15  value 470R  Power: 1/10W  Tolerance: 1%  [RESC0603]  (hidden comment: RESC0603)
R16  value 470R  Power: 1/10W  Tolerance: 1%  [RESC0603]  (hidden comment: RESC0603)
R17  value 470R  Power: 1/10W  Tolerance: 1%  [RESC0603]  (hidden comment: RESC0603)
R18  value 470R  Power: 1/10W  Tolerance: 1%  [RESC0603]  (hidden comment: RESC0603)
R19  value 470R  Power: 1/10W  Tolerance: 1%  [RESC0603]  (hidden comment: RESC0603)
R20  value 470R  Power: 1/10W  Tolerance: 1%  [RESC0603]  (hidden comment: RESC0603)
R21  value 470R  Power: 1/10W  Tolerance: 1%  [RESC0603]  (hidden comment: RESC0603)
R22  value 470R  Power: 1/10W  Tolerance: 1%  [RESC0603]  (hidden comment: RESC0603)
R23  value 470R  Power: 1/10W  Tolerance: 1%  [RESC0603]  (hidden comment: RESC0603)
R24  value 470R  Power: 1/10W  Tolerance: 1%  [RESC0603]  (hidden comment: RESC0603)
R25  value 470R  Power: 1/10W  Tolerance: 1%  [RESC0603]  (hidden comment: RESC0603)
R26  value 470R  Power: 1/10W  Tolerance: 1%  [RESC0603]  (hidden comment: RESC0603)
R27  value 470R  Power: 1/10W  Tolerance: 1%  [RESC0603]  (hidden comment: RESC0603)
R28  value 470R  Power: 1/10W  Tolerance: 1%  [RESC0603]  (hidden comment: RESC0603)
R29  value 10K  Power: 1/10W  Tolerance: 1%  [RESC0603]  (hidden comment: RESC0603)
R30  value 10K  Power: 1/10W  Tolerance: 1%  [RESC0603]  (hidden comment: RESC0603)
R157  value 10K  Power: 1/10W  Tolerance: 1%  [RESC0603]  (hidden comment: RESC0603)
R158  value 10K  Power: 1/10W  Tolerance: 1%  [RESC0603]  (hidden comment: RESC0603)
R159  value 10K  Power: 1/10W  Tolerance: 1%  [RESC0603]  (hidden comment: RESC0603)
R160  value 10K  Power: 1/10W  Tolerance: 1%  [RESC0603]  (hidden comment: RESC0603)
R161  value 470R  Power: 1/10W  Tolerance: 1%  [RESC0603]  (hidden comment: RESC0603)
R162  RESC0805  [RESC0805]  (value not drawn)
R163  RESC0805  [RESC0805]  (value not drawn)
R164  value 10K  Power: 1/10W  Tolerance: 1%  [RESC0603]  (hidden comment: RESC0603)
R165  value 470R  Power: 1/10W  Tolerance: 1%  [RESC0603]  (hidden comment: RESC0603)
R166  value 470R  Power: 1/10W  Tolerance: 1%  [RESC0603]  (hidden comment: RESC0603)
SW1  SWITCH-E-SWITCH-TL1105SFP  [SWITCH-ESWITCH-TL1105SPF-1RCAP]  (value not drawn)
SW2  SWITCH-E-SWITCH-TL1105SFP  [SWITCH-ESWITCH-TL1105SPF-1RCAP]  (value not drawn)
SW3  SWITCH-E-SWITCH-TL1105SFP  [SWITCH-ESWITCH-TL1105SPF-1RCAP]  (value not drawn)
SW4  PEC12R-XX
SW5  SWITCH-E-SWITCH-TL1105SFP  [SWITCH-ESWITCH-TL1105SPF-1RCAP]  (value not drawn)
SW6  SWITCH-E-SWITCH-TL1105SFP  [SWITCH-ESWITCH-TL1105SPF-1RCAP]  (value not drawn)
SW7  SWITCH-E-SWITCH-TL1105SFP  [SWITCH-ESWITCH-TL1105SPF-1RCAP]  (value not drawn)
SW8  SWITCH-E-SWITCH-TL1105SFP  [SWITCH-ESWITCH-TL1105SPF-1RCAP]  (value not drawn)
SW9  SWITCH-E-SWITCH-TL1105SFP  [SWITCH-ESWITCH-TL1105SPF-1RCAP]  (value not drawn)
SW10  SWITCH-E-SWITCH-TL1105SFP  [SWITCH-ESWITCH-TL1105SPF-1RCAP]  (value not drawn)
SW11  SWITCH-E-SWITCH-TL1105SFP  [SWITCH-ESWITCH-TL1105SPF-1RCAP]  (value not drawn)
SW12  SWITCH-E-SWITCH-TL1105SFP  [SWITCH-ESWITCH-TL1105SPF-1RCAP]  (value not drawn)
SW13  SWITCH-E-SWITCH-TL1105SFP  [SWITCH-ESWITCH-TL1105SPF-1RCAP]  (value not drawn)
SW14  SWITCH-E-SWITCH-TL1105SFP  [SWITCH-ESWITCH-TL1105SPF-1RCAP]  (value not drawn)
SW15  SWITCH-E-SWITCH-TL1105SFP  [SWITCH-ESWITCH-TL1105SPF-1RCAP]  (value not drawn)
SW16  SWITCH-E-SWITCH-TL1105SFP  [SWITCH-ESWITCH-TL1105SPF-1RCAP]  (value not drawn)
SW17  SWITCH-E-SWITCH-TL1105SFP  [SWITCH-ESWITCH-TL1105SPF-1RCAP]  (value not drawn)
SW18  SWITCH-E-SWITCH-TL1105SFP  [SWITCH-ESWITCH-TL1105SPF-1RCAP]  (value not drawn)
SW19  SWITCH-E-SWITCH-TL1105SFP  [SWITCH-ESWITCH-TL1105SPF-1RCAP]  (value not drawn)
SW20  SWITCH-E-SWITCH-TL1105SFP  [SWITCH-ESWITCH-TL1105SPF-1RCAP]  (value not drawn)
U1  PCAL9555  (value not drawn)
U2  PCAL9555  (value not drawn)
U3  PCAL9555  (value not drawn)

### Blocks framed on the sheet
Marker / Trace: D1 D2 D20 D21 R164 SW1 SW2 SW4 SW13 SW19 SW20
Power: DISP1 R6 R162 R163 SW3

### Ports
KEYINT-A (out), KEYINT-B (out), LCD-D4 (out, see PROCESSOR[3B]), LCD-D5 (out, see PROCESSOR[3B]), LCD-D6 (out, see PROCESSOR[3B]), LCD-D7 (out, see PROCESSOR[3C]), LCD-E (out, see PROCESSOR[3C]), LCD-RS (out, see PROCESSOR[3C]), LCD-RW (out, see PROCESSOR[3C]), LEDILIMIT (out), LEDPLIMIT (out), POWERON (out), ROTPHA (out, see PROCESSOR[3A]), ROTPHB (out, see PROCESSOR[3A]), SCL (out, see MULTIPLIER[3B], PROCESSOR[6A], SWEEP[6C]), SDA (out, see MULTIPLIER[3C], PROCESSOR[6A], SWEEP[6C])

### Nets
FGND: C1.2 C2.2 C3.2 C4.2 C5.2 C6.2 C7.2 C8.2 C9.2 DISP1.1(GND) DISP1.5(R/~{W}) J1.19(-) J1.20(-) Q1.2(E) R3.2 R5.2 R157.2 R158.2 R161.1 SW1.4 SW2.2 SW3.2 SW4.2 SW4.4 SW5.4 SW6.3 SW7.2 SW8.3 SW9.3 SW10.3 SW11.4 SW12.2 SW13.2 SW14.1 SW15.3 SW16.3 SW17.3 SW18.3 SW19.4 SW20.2 U1.2(A1) U1.12(GND) U1.21(A0) U2.2(A1) U2.12(GND) U3.2(A1) U3.3(A2) U3.12(GND) U3.21(A0)
FP5VD: C1.1 C2.1 C3.1 C4.1 C5.1 C6.1 C7.1 C8.1 C9.1 D1.2(K) D2.2(K) D3.2(K) D4.2(K) D5.2(K) D6.2(K) D7.2(K) D8.2(K) D9.2(K) D10.2(K) D11.2(K) D12.2(K) D13.2(K) D14.2(K) D15.2(K) D16.2(K) D17.2(K) D18.2(K) D19.2(K) D20.2(K) D21.2(K) D40.2(K) D47.2(K) DISP1.2(VCC) DISP1.15(LED+) J1.1(+) J1.2(-) R1.2 R2.2 R4.2 R29.2 R30.2 R159.2 R160.2 R164.2 U1.3(A2) U1.24(VCC) U2.3(A2) U2.21(A0) U2.24(VCC) U3.24(VCC)
GND: J2.19(-) J2.20(-)
P5VD: J2.1(+) J2.2(-)
BTN-ALTERNATE: SW11.1 U3.11(P0-7)
BTN-BIPFET: SW7.3 U3.4(P0-0)
BTN-CHA: SW5.1 U3.20(P1-7)
BTN-CHB: SW6.2 U3.19(P1-6)
BTN-DUTAB: SW20.3 U3.5(P0-1)
BTN-IMAXDN: SW15.2 U3.17(P1-4)
BTN-IMAXUP: SW8.1 U3.18(P1-5)
BTN-MARK12: SW2.3 U3.6(P0-2)
BTN-NPN-PNP: SW12.3 U3.8(P0-4)
BTN-PAGE: SW1.1 U3.9(P0-5)
BTN-PMAXDN: SW17.2 U3.13(P1-0)
BTN-PMAXUP: SW10.1 U3.14(P1-1)
BTN-ROTCLICK: R164.1 SW4.5 U2.4(P0-0)
BTN-RUNSTOP: SW18.2 U3.10(P0-6)
BTN-SETUP: SW14.4 U2.5(P0-1)
BTN-TRCNT: SW13.3 U2.6(P0-2)
BTN-TRSEL: SW19.1 U3.7(P0-3)
BTN-VMAXDN: SW9.1 SW16.2 U3.15(P1-2) U3.16(P1-3)
F-KEYINT-A: J1.8(-) R159.1 U3.1(~{INT})
F-KEYINT-B: J1.10(-) R160.1 U2.1(~{INT})
F-LCD4: DISP1.11(D4) J1.11(-)
F-LCD5: DISP1.12(D5) J1.13(-)
F-LCD6: DISP1.13(D6) J1.15(-)
F-LCD7: DISP1.14(D7) J1.17(-)
F-LCDE: DISP1.6(E) J1.9(-)
F-LCDRS: DISP1.4(RS) J1.5(-)
F-POWERON: J1.3(-) SW3.3
F-SCL: J1.4(-) R29.1 U1.22(SCL) U2.22(SCL) U3.22(SCL)
F-SDA: J1.6(-) R30.1 U1.23(SDA) U2.23(SDA) U3.23(SDA)
KEYINT-A: J2.8(-) ; port KEYINT-A
KEYINT-B: J2.10(-) ; port KEYINT-B
LCD-D4: J2.11(-) ; port LCD-D4
LCD-D5: J2.13(-) ; port LCD-D5
LCD-D6: J2.15(-) ; port LCD-D6
LCD-D7: J2.17(-) ; port LCD-D7
LCD-E: J2.9(-) ; port LCD-E
LCD-RS: J2.5(-) ; port LCD-RS
LCD-RW: J2.7(-) ; port LCD-RW
LED-2mA: R18.2 U1.13(P1-0)
LED-20mA: R19.2 U1.11(P0-7)
LED-200mA: R20.2 U1.10(P0-6)
LED-ALT: R28.2 U2.19(P1-6)
LED-BACKLIGHT: R7.2 U1.20(P1-7)
LED-BIP: R12.2 U1.19(P1-6)
LED-CHA: R16.2 U1.15(P1-2)
LED-CHB: R17.2 U1.14(P1-1)
LED-FET: R15.2 U1.16(P1-3)
LED-ILIMIT: J1.12(-) R165.2
LED-MRK-1: R8.2 U2.18(P1-5)
LED-MRK-2: R11.2 U2.15(P1-2)
LED-MRK-A: R9.2 U2.17(P1-4)
LED-MRK-B: R10.2 U2.16(P1-3)
LED-NPN: R14.2 U1.17(P1-4)
LED-PLIMIT: J1.14(-) R166.2
LED-PMAX4W: R26.2 U1.4(P0-0)
LED-PMAX40mW: R24.2 U1.6(P0-2)
LED-PMAX400mW: R25.2 U1.5(P0-1)
LED-PNP: R13.2 U1.18(P1-5)
LED-RUNSTOP: R27.2 U2.20(P1-7)
LED-VMAX2V: R21.2 U1.9(P0-5)
LED-VMAX10V: R22.2 U1.8(P0-4)
LED-VMAX40V: R23.2 U1.7(P0-3)
LEDILIMIT: J2.12(-) ; port LEDILIMIT
LEDPLIMIT: J2.14(-) ; port LEDPLIMIT
POWERON: J2.3(-) ; port POWERON
ROT-PHA: J1.16(-) R2.1 SW4.1
ROT-PHB: J1.18(-) R1.1 SW4.3
ROTPHA: J2.16(-) ; port ROTPHA
ROTPHB: J2.18(-) ; port ROTPHB
SCL: J2.4(-) ; port SCL
SDA: J2.6(-) ; port SDA
NetD1_1: D1.1(A) R11.1
NetD2_1: D2.1(A) R8.1
NetD3_1: D3.1(A) R16.1
NetD4_1: D4.1(A) R12.1
NetD5_1: D5.1(A) R17.1
NetD6_1: D6.1(A) R15.1
NetD7_1: D7.1(A) R20.1
NetD8_1: D8.1(A) R23.1
NetD9_1: D9.1(A) R26.1
NetD10_1: D10.1(A) R28.1
NetD11_1: D11.1(A) R13.1
NetD12_1: D12.1(A) R14.1
NetD13_1: D13.1(A) R19.1
NetD14_1: D14.1(A) R22.1
NetD15_1: D15.1(A) R25.1
NetD16_1: D16.1(A) R18.1
NetD17_1: D17.1(A) R21.1
NetD18_1: D18.1(A) R24.1
NetD19_1: D19.1(A) R27.1
NetD20_1: D20.1(A) R10.1
NetD21_1: D21.1(A) R9.1
NetD40_1: D40.1(A) R165.1
NetD47_1: D47.1(A) R166.1
NetDISP1_3: DISP1.3(CTR) R4.1 R161.2
NetDISP1_7: DISP1.7(D0) R3.1
NetDISP1_8: DISP1.8(D1) R5.1
NetDISP1_9: DISP1.9(D2) R157.1
NetDISP1_10: DISP1.10(D3) R158.1
NetDISP1_16: DISP1.16(LED-) R6.2 R162.2 R163.2
NetQ1_1: Q1.1(B) R7.1
NetQ1_3: Q1.3(C) R6.1 R162.1 R163.1

Not connected (* = marked no-connect by the designer): J1 7(-); SW1 2 3; SW2 1 4; SW3 1 4; SW5 2 3; SW6 1 4; SW7 1 4; SW8 2 4; SW9 2 4; SW10 2 4; SW11 2 3; SW12 1 4; SW13 1 4; SW14 2 3; SW15 1 4; SW16 1 4; SW17 1 4; SW18 1 4; SW19 2 3; SW20 1 4; U1 1(~{INT}); U2 7(P0-3) 8(P0-4) 9(P0-5) 10(P0-6) 11(P0-7) 13(P1-0) 14(P1-1)

### Notes on the sheet
- (near R1) DO WE NEED KEYINTB
- (near R1) MAKE ROTCLICK
- (near LOGO?#2) Instruments
- (near DISP1) CT9042 Curve Tracer
- (near D2) 1
- (near D1) 2
- Marker
- (near SW1) PAGE
- (near SW2) MARKER
- (near R6) BACKLIGHT CURRENT LIMIT
- Config
- Bipolar
- (near D6) FET
- DUT
- B
- (near SW8) Vmax
- (near SW8) Limit
- Imax
- (near SW9) Limit
- Pmax
- (near SW10) Limit
- (near SW11) Alt
- (near SW11) Oper
- (near D3) A
- (near D11) P
- (near D12) N
- (near SW13) Count
- B/G
- (near D21) A
- (near D20) B
- (near SW14) Setup
- C/D
- E/S
- (near SW15) Range
- (near SW16) Range
- (near SW17) Range
- (near SW18) Run/Stop
- (near SW19) Select
- Trace
- (near SW20) DUT
- MARKER /TRACE OPERATION
- USE 1 / 2 TO TOGGLE BETWEEN MARKERS
- USE DUT TO TOGGLE BETWEEN DEVICES
- SPINNING MOVES SELECTED MARKERS ( YOU CAN HAVE 4 : 2 PER DEVICE, 2 DEVICES)
- CLICK COUNT , THEN SPIN TO SELECT TRACE COUNT. CLICK ROTARY TO CONFIRM
- CLICK SELECT , THEN SPIN TO SELECT TRACE. CLICK ROTARY TO CONFIRM
- USE PAGE BUTTON TO CHANGE DISPLAY PAGES
- 100 = LED BANK 1
- (near U2) 101 = LED BANK 2
- (near U3) 000 = BUTTON BANK
- Labels drawn without touching a wire or pin: F-KEYINT-B
- (in symbol CAPC-0805-10uF-25V) 0805
- (in symbol IC-NEXPERIA-PCAL9555A) 0100_XXXR
- (in symbol LOGO-SILICONVALLEYGARAGE-SMALL) SILICONVALLEYGARAGE
- (in symbol RESC-0603-1K-1%-1/10W) 0603
- (in symbol RESC-0603-10K-1%-1/10W) 0603
- (in symbol RESC-0603-470R-1%-1/10W) 0603
- (in symbol RESC-0805-GENERIC) 0805

### Library data of the parts
C1 C4 C6 C8 = CAPC-0603-100nF-50V-X7R: as C29-C32 on sheet MULTIPLIER; Package / Case: 0603; Location: *; Supplier 1: Mouser; Supplier Part Number 1: 80-C0603C104K5R7867; Supplier 2: Mouser; Supplier Part Number 2: 80-C0603C104K5R7411; Supplier 3: Avnet; Supplier Part Number 3: KGM15BR71H104KT; Supplier 4: Digikey; Supplier Part Number 4: 1276-1000-1-ND; LCSC: C127833; MOUSER: 80-C0603C104K5R
C2 C3 C5 C7 C9 = CAPC-0805-10uF-25V: CAPACITOR,CERAMIC,10uF,25V,X5R,0805; Manufacturer 1: SAMSUNG; Manufacturer Part Number 1: CL21B106KAYQNNE; Package / Case: 0805 (2012 metric); Location: *; LCSC: C3039694; MOUSER: 187-CL21B106KAYQNNE
D1-D21 D40 D47 = LED-3MM-GREEN: LED,TH,GREEN,42mCd,3MM; Manufacturer 1: WURTH; Manufacturer Part Number 1: 151031VS06000; MOUSER: 78-VLMPG33N1P2; Supplier 1: Mouser; Supplier Part Number 1: 78-VLMPG33N1P2
DISP1 = DISPLAY-LCD-2X40: DISPLAY,LCD,ALPHA,2X40CHAR,HD44780,YELLOW BL
J1 J2 = CONN-BOXHEADER-10X2
LOGO?#2 = LOGO-SILICONVALLEYGARAGE-SMALL: LOGO,SILICONVALLEYGARAGE,SMALL
Q1 = XSTR-NPN-BC847: XSTR,NPN,45V,0.1A,,BC847B,SOT23
R1-R5 R29 R30 R157-R160 R164 = RESC-0603-10K-1%-1/10W: RESISTOR,10K,1%,100mW,0603 (1608); Manufacturer 1: YAGEO; Manufacturer Part Number 1: RC0603FR-0710KL; Location: *; LCSC: C25804; MOUSER: 603-RC0603FR-0710KL
R6 R162 R163 = RESC-0805-GENERIC: RESISTOR,GENERIC,0805; Location: *; Parameter 4: *; Power: *; Tolerance: *; Value: *
R7 = RESC-0603-1K-1%-1/10W: RESISTOR,1K,1%,100mW,0603 (1608); Manufacturer 1: YAGEO; Manufacturer Part Number 1: RC0603FR-071KL; Location: *; LCSC: C21190; MOUSER: 603-RC0603FR-071KL
R8-R28 R161 R165 R166 = RESC-0603-470R-1%-1/10W: RESISTOR,470R,1%,100mW,0603 (1608); Location: *; LCSC: C23179
SW1-SW3 SW5-SW20 = SWITCH-E-SWITCH-TL1105SFP: SW,SMD,TACT,4PIN,TH,160g TOP ACTUATOR FOR CAP,E-SWITCH,TL1105SPF160; Manufacturer Part Number 1: TL1105SPF160Q; DIGIKEY: EG1861-ND; Manufacturer 1: E-SWITCH
SW4 = SWITCH-BOURNS-PEC12R
U1-U3 = IC-NEXPERIA-PCAL9555A: I2C,16BIT AGILE I/O EXPANDER,INT,NEXPERIA,PCAL95555,TSSOP24; Manufacturer Part Number 1: PCAL9555APW,118; DIGIKEY: 568-9928-1-ND; LCSC: C2669740; Manufacturer 1: NEXPERIA

## Sheet PROCESSOR.SchDoc
size Tabloid; SheetNumber: 3; SheetTotal: 9
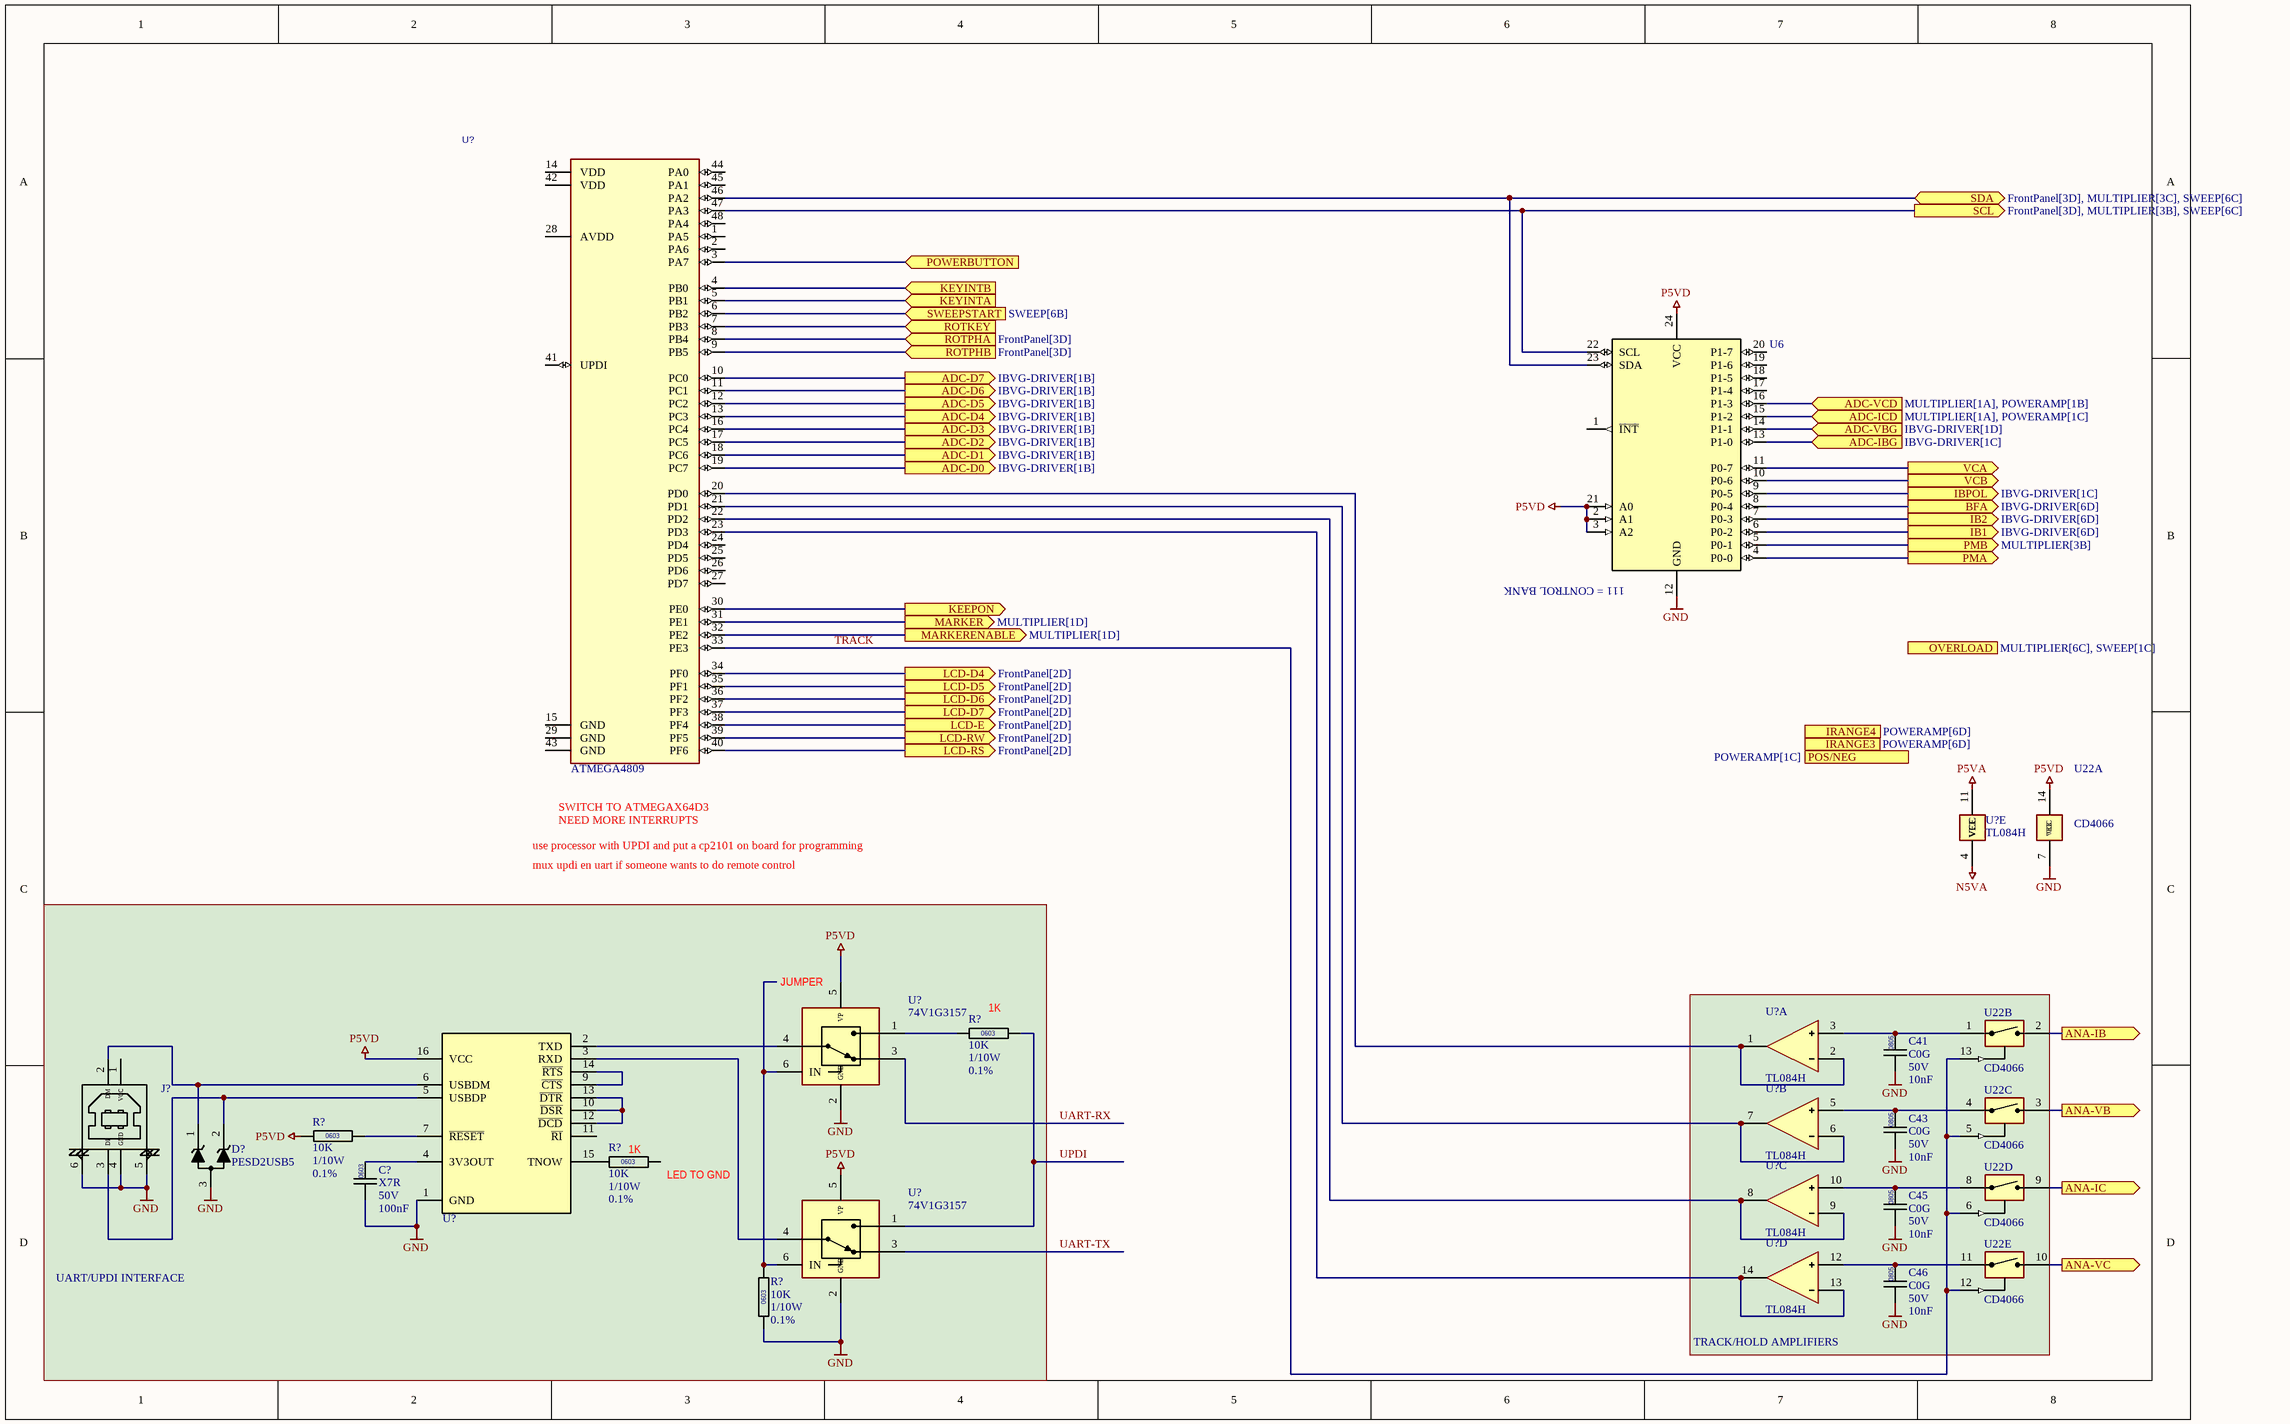
[diagram p9: PROCESSOR.SchDoc]

### Parts
(Parts that share a designator on the sheet are numbered #1, #2 ... from top to bottom, then left to right.)
C41  Dielectric: C0G  Voltage: 50V  Capacitance: 10nF  [CAPC0805]  (hidden comment: CAP0805)
C43  Dielectric: C0G  Voltage: 50V  Capacitance: 10nF  [CAPC0805]  (hidden comment: CAP0805)
C45  Dielectric: C0G  Voltage: 50V  Capacitance: 10nF  [CAPC0805]  (hidden comment: CAP0805)
C46  Dielectric: C0G  Voltage: 50V  Capacitance: 10nF  [CAPC0805]  (hidden comment: CAP0805)
C?#6  Dielectric: X7R  Voltage: 50V  Capacitance: 100nF  [CAPC0603]  (hidden comment: CAP0603)
D?#5  PESD2USB5  [SOT23]
J?  CONN-CUI-UJ2-BH-BL1-TH  (value not drawn)
R?#9  value 10K  Power: 1/10W  Tolerance: 0.1%  [RESC0603]  (hidden comment: RESC0603)
R?#10  value 10K  Power: 1/10W  Tolerance: 0.1%  [RESC0603]  (hidden comment: RESC0603)
R?#11  value 10K  Power: 1/10W  Tolerance: 0.1%  [RESC0603]  (hidden comment: RESC0603)
R?#12  value 10K  Power: 1/10W  Tolerance: 0.1%  [RESC0603]  (hidden comment: RESC0603)
U6  PCAL9555  (value not drawn)
U22  CD4066  [SO127P600-14N]  (parts A,B,C,D,E of 5)
U?#9  ATMEGA4809  [QFN50P700X700X-44-TH520X520]
U?#10  TL084H  [SO127P600-14N]  (part E of 5)
U?#11  74V1G3157  [SOT23-6]
U?#12  TL084H  [SO127P600-14N]  (part A of 5)
U?#13  CP2102  [SO127P600-16N]  (value not drawn)
U?#14  TL084H  [SO127P600-14N]  (part B of 5)
U?#15  TL084H  [SO127P600-14N]  (part C of 5)
U?#16  74V1G3157  [SOT23-6]
U?#17  TL084H  [SO127P600-14N]  (part D of 5)

### Blocks framed on the sheet
TRACK/HOLD AMPLIFIERS: C41 C43 C45 C46 U22 U?#12 U?#14 U?#15 U?#17

### Ports
ADC-D0 (out, see IBVG-DRIVER[1B]), ADC-D1 (out, see IBVG-DRIVER[1B]), ADC-D2 (out, see IBVG-DRIVER[1B]), ADC-D3 (out, see IBVG-DRIVER[1B]), ADC-D4 (out, see IBVG-DRIVER[1B]), ADC-D5 (out, see IBVG-DRIVER[1B]), ADC-D6 (out, see IBVG-DRIVER[1B]), ADC-D7 (out, see IBVG-DRIVER[1B]), ADC-IBG (in, see IBVG-DRIVER[1C]), ADC-ICD (in, see MULTIPLIER[1A], POWERAMP[1C]), ADC-VBG (in, see IBVG-DRIVER[1D]), ADC-VCD (in, see MULTIPLIER[1A], POWERAMP[1B]), ANA-IB (out), ANA-IC (out), ANA-VB (out), ANA-VC (out), BFA (out, see IBVG-DRIVER[6D]), IB1 (out, see IBVG-DRIVER[6D]), IB2 (out, see IBVG-DRIVER[6D]), IBPOL (out, see IBVG-DRIVER[1C]), IRANGE3 (out, see POWERAMP[6D]), IRANGE4 (out, see POWERAMP[6D]), KEEPON (out), KEYINTA (in), KEYINTB (in), LCD-D4 (out, see FrontPanel[2D]), LCD-D5 (out, see FrontPanel[2D]), LCD-D6 (out, see FrontPanel[2D]), LCD-D7 (out, see FrontPanel[2D]), LCD-E (out, see FrontPanel[2D]), LCD-RS (out, see FrontPanel[2D]), LCD-RW (out, see FrontPanel[2D]), MARKER (out, see MULTIPLIER[1D]), MARKERENABLE (out, see MULTIPLIER[1D]), OVERLOAD (in, see MULTIPLIER[6C], SWEEP[1C]), PMA (out), PMB (out, see MULTIPLIER[3B]), POS/NEG (out, see POWERAMP[1C]), POWERBUTTON (in), ROTKEY (in), ROTPHA (in, see FrontPanel[3D]), ROTPHB (in, see FrontPanel[3D]), SCL (out, see FrontPanel[3D], MULTIPLIER[3B], SWEEP[6C]), SDA (bidir, see FrontPanel[3D], MULTIPLIER[3C], SWEEP[6C]), SWEEPSTART (in, see SWEEP[6B]), VCA (out), VCB (out)

### Nets
GND: C41.2 C43.2 C45.2 C46.2 C?#6.2 D?#5.3(A) J?.4(GND) J?.5(NO) J?.6(NO) R?#12.2 U6.12(GND) U22.7(VEE) U?#11.2(GND) U?#13.1(GND) U?#16.2(GND)
N5VA: U?#10.4(VCC)
P5VA: U?#10.11(VEE)
P5VD: R?#10.2 U6.2(A1) U6.3(A2) U6.21(A0) U6.24(VCC) U22.14(VCC) U?#11.5(VP) U?#13.16(VCC) U?#16.5(VP)
ADC-D0: U?#9.19(PC7) ; port ADC-D0
ADC-D1: U?#9.18(PC6) ; port ADC-D1
ADC-D2: U?#9.17(PC5) ; port ADC-D2
ADC-D3: U?#9.16(PC4) ; port ADC-D3
ADC-D4: U?#9.13(PC3) ; port ADC-D4
ADC-D5: U?#9.12(PC2) ; port ADC-D5
ADC-D6: U?#9.11(PC1) ; port ADC-D6
ADC-D7: U?#9.10(PC0) ; port ADC-D7
ADC-IBG: U6.13(P1-0) ; port ADC-IBG
ADC-ICD: U6.15(P1-2) ; port ADC-ICD
ADC-VBG: U6.14(P1-1) ; port ADC-VBG
ADC-VCD: U6.16(P1-3) ; port ADC-VCD
ANA-IB: U22.2 ; port ANA-IB
ANA-IC: U22.9 ; port ANA-IC
ANA-VB: U22.3 ; port ANA-VB
ANA-VC: U22.10 ; port ANA-VC
BFA: U6.8(P0-4) ; port BFA
IB1: U6.6(P0-2) ; port IB1
IB2: U6.7(P0-3) ; port IB2
IBPOL: U6.9(P0-5) ; port IBPOL
KEEPON: U?#9.30(PE0) ; port KEEPON
KEYINTA: U?#9.5(PB1) ; port KEYINTA
KEYINTB: U?#9.4(PB0) ; port KEYINTB
LCD-D4: U?#9.34(VCC) ; port LCD-D4
LCD-D5: U?#9.35(GND) ; port LCD-D5
LCD-D6: U?#9.36(PF2) ; port LCD-D6
LCD-D7: U?#9.37(PF3) ; port LCD-D7
LCD-E: U?#9.38(PF4) ; port LCD-E
LCD-RS: U?#9.40(PF6) ; port LCD-RS
LCD-RW: U?#9.39(PF5) ; port LCD-RW
MARKER: U?#9.31(PE1) ; port MARKER
MARKERENABLE: U?#9.32(PE2) ; port MARKERENABLE
PMA: U6.4(P0-0) ; port PMA
PMB: U6.5(P0-1) ; port PMB
POWERBUTTON: U?#9.3(PA7) ; port POWERBUTTON
ROTKEY: U?#9.7(PB3) ; port ROTKEY
ROTPHA: U?#9.8(PB4) ; port ROTPHA
ROTPHB: U?#9.9(PB5) ; port ROTPHB
SCL: U6.22(SCL) U?#9.47(PA3) ; port SCL
SDA: U6.23(SDA) U?#9.46(PA2) ; port SDA
SWEEPSTART: U?#9.6(PB2) ; port SWEEPSTART
TRACK: U22.5 U22.6 U22.12 U22.13 U?#9.33(PE3)
UART-RX: U?#11.3(B1)
UART-TX: U?#16.3(B1)
UPDI: R?#9.1 U?#16.1(NO)
VCA: U6.11(P0-7) ; port VCA
VCB: U6.10(P0-6) ; port VCB
NetC41_1: C41.1 U22.1 U?#12.3(+)
NetC43_1: C43.1 U22.4 U?#14.5(+)
NetC45_1: C45.1 U22.8 U?#15.10(+)
NetC46_1: C46.1 U22.11 U?#17.12(+)
NetC?#6_1: C?#6.1 U?#13.4(3V3OUT)
NetD?#5_1: D?#5.1(K) J?.2(DM) U?#13.6(USBDM)
NetD?#5_2: D?#5.2(A) J?.3(DP) U?#13.5(USBDP)
NetR?#9_2: R?#9.2 U?#11.1(NO)
NetR?#10_1: R?#10.1 U?#13.7(~{RESET})
NetR?#11_2: R?#11.2 U?#13.15(TNOW)
NetR?#12_1: R?#12.1 U?#11.6(IN) U?#16.6(IN)
NetU?#9_20: U?#9.20(PD0) U?#12.1(O) U?#12.2(-)
NetU?#9_21: U?#9.21(PD1) U?#14.6(-) U?#14.7(O)
NetU?#9_22: U?#9.22(PD2) U?#15.8(O) U?#15.9(-)
NetU?#9_23: U?#9.23(GND) U?#17.13(-) U?#17.14(O)
NetU?#11_4: U?#11.4(COM) U?#13.2(TXD)
NetU?#13_3: U?#13.3(RXD) U?#16.4(COM)
NetU?#13_9: U?#13.9(~{CTS}) U?#13.14(~{RTS})
NetU?#13_10: U?#13.10(~{DSR}) U?#13.12(~{DCD}) U?#13.13(~{DTR})

Not connected (* = marked no-connect by the designer): J? 1(VCC); R?#11 1; U6 1(~{INT}) 17(P1-4) 18(P1-5) 19(P1-6) 20(P1-7); U?#9 1(PA5) 2(PA6) 14(VDD) 15(GND) 24(PD4) 25(PD5) 26(PD6) 27(PD7) 28(AVDD) 29(GND) 41(UPDI) 42(VDD) 43(GND) 44(AVCC) 45(PA1) 48(PA4); U?#13 11(~{RI})

### Notes on the sheet
- (near U6) 111 = CONTROL BANK
- use processor with UPDI and put a cp2101 on board for programming
- SWITCH TO ATMEGAX64D3
- NEED MORE INTERRUPTS
- mux updi en uart if someone wants to do remote control
- (near U?#11) JUMPER
- (near R?#9) 1K
- (near R?#11) 1K
- (near R?#11) LED TO GND
- UART/UPDI INTERFACE
- (in symbol CAPC-0805-10nF-50V-C0G) 0805
- (in symbol RESC-0603-10K-0.1%-1/10W) 0603

### Library data of the parts
C41 C43 C45 C46 = CAPC-0805-10nF-50V-C0G: CAPACITOR,CERAMIC,10nF,100V,C0G,0805; Manufacturer 1: KEMET; Manufacturer Part Number 1: C0805C103K5GEC7210; Package / Case: 0805 (2012 metric); Location: *; DIGIKEY: 399-C0805C103K5GEC7210CT-ND
C?#6 = CAPC-0603-100nF-50V-X7R: as C29-C32 on sheet MULTIPLIER; Package / Case: 0603; Location: *; Supplier 1: Mouser; Supplier Part Number 1: 80-C0603C104K5R7867; Supplier 2: Mouser; Supplier Part Number 2: 80-C0603C104K5R7411; Supplier 3: Avnet; Supplier Part Number 3: KGM15BR71H104KT; Supplier 4: Digikey; Supplier Part Number 4: 1276-1000-1-ND; LCSC: C127833; MOUSER: 80-C0603C104K5R
D?#5 = TVS-NEXPERIA-PESD2USB5UX-TR: DIODE,TVS,DUAL,NIDIRETIONAL,USB,PESD2USB5UX-TR,SOT23; DIGIKEY: 1727-PESD2USB5UX-CT-ND; Manufacturer 1: NEXPERIA; Manufacturer Part Number 1: PESD2USB5UX-TR
J? = CONN-CUI-UJ2-BH-BL1-TH: CONN,USB2.0,B,RA,BLUE
R?#9-R?#12 = RESC-0603-10K-0.1%-1/10W: RESISTOR,10K,0.1%,100mW,0603 (1608); Location: *
U6 = IC-NEXPERIA-PCAL9555A: as U1 on sheet FrontPanel; DIGIKEY: 568-9928-1-ND; Manufacturer 1: NEXPERIA
U22 = IC-TI-CD4066-SO14: IC,ANALOG,4XSPST ANALOG SWITCH,NO,TI,CD4016,SO14; Manufacturer Part Number 1: CD4066BM96; DIGIKEY: 296-14475-1-ND; Manufacturer 1: TI
U?#9 = IC-ATMEL-ATMEGA4809-QFP48: IC,CPU,ATMEGA4809,QFP48
U?#10 U?#12 U?#14 U?#15 U?#17 = IC-TI-TL084-SO14: IC,OPAMP JFET,QUAD,TL084HIDR,SO14; Manufacturer 1: TI; Manufacturer Part Number 1: TL082HIDR; MOUSER: 595-TL082HIDR
U?#11 U?#16 = IC-TI-SN74LVC1G3157DBVR: IC,ANALOG,SPDT ANALOG SWITCH,SINGLEGATE,TI,SN74LVC1G3157DBVR,SOT23-6; DIGIKEY: 296-14908-1-ND; Manufacturer 1: TI; Manufacturer Part Number 1: SN74LVC1G3157DBVR
U?#13 = IC-WCH-CH340B: IC,XCVR,USB UART WITH XTAL AND EEPROM,WCH,CH340G-SO16; Manufacturer Part Number 1: FT231XS-R; Manufacturer 1: WCH; MOUSER: CH340B

## Nets that join several sheets
AGND: CT9042 Toplevel (9 pins), PSU (20 pins), POWERAMP (11 pins), IBVG-DRIVER (11 pins), SWEEP (28 pins), MULTIPLIER (14 pins), POWERMUX (8 pins)
GND: POWERAMP (Q9.2 Q10.2 U11.1 U30.5), IBVG-DRIVER (26 pins), MULTIPLIER (13 pins), FrontPanel (J2.19 J2.20), PROCESSOR (15 pins)
N5VA: PSU (C52.2 D63.2 D67.1 U19.11), POWERAMP (12 pins), IBVG-DRIVER (7 pins), SWEEP (C75.1 C80.2 U12.4 U1000.4), MULTIPLIER (6 pins), PROCESSOR (U?#10.4)
N15VA: PSU (6 pins), IBVG-DRIVER (13 pins), SWEEP (C76.2 D22.1 U1001.4), MULTIPLIER (5 pins)
N48V: PSU (8 pins), POWERAMP (D35.1)
P5VA: PSU (5 pins), POWERAMP (11 pins), IBVG-DRIVER (7 pins), SWEEP (14 pins), MULTIPLIER (17 pins), PROCESSOR (U?#10.11)
P5VD: PSU (Q16.3), FrontPanel (J2.1 J2.2), PROCESSOR (9 pins)
P5VREL: PSU (7 pins), POWERAMP (D36.3 D37.3 K1.1 K2.1), IBVG-DRIVER (6 pins), POWERMUX (8 pins)
P15VA: PSU (5 pins), IBVG-DRIVER (16 pins), SWEEP (C74.1 D22.2 U1001.8), MULTIPLIER (5 pins)
P48V: PSU (8 pins), POWERAMP (D231.2)
VREF: IBVG-DRIVER (R38.1), SWEEP (5 pins), MULTIPLIER (R111.2 R114.2)
ADC-D0: IBVG-DRIVER (U10.16), PROCESSOR (U?#9.19)
ADC-D1: IBVG-DRIVER (U10.15), PROCESSOR (U?#9.18)
ADC-D2: IBVG-DRIVER (U10.14), PROCESSOR (U?#9.17)
ADC-D3: IBVG-DRIVER (U10.13), PROCESSOR (U?#9.16)
ADC-D4: IBVG-DRIVER (U10.12), PROCESSOR (U?#9.13)
ADC-D5: IBVG-DRIVER (U10.11), PROCESSOR (U?#9.12)
ADC-D6: IBVG-DRIVER (U10.10), PROCESSOR (U?#9.11)
ADC-D7: IBVG-DRIVER (U10.9 U206.9), PROCESSOR (U?#9.10)
ADC-IBG: IBVG-DRIVER (D29.3 R59.1), PROCESSOR (U6.13)
ADC-ICD: POWERAMP (U13.4), MULTIPLIER (U14.6 U15.1 U101.3), PROCESSOR (U6.15)
ADC-VBG: IBVG-DRIVER (R73.1 R76.1), PROCESSOR (U6.14)
ADC-VCD: POWERAMP (R243.1 U30.1 U30.3 U213.3), MULTIPLIER (U15.7), PROCESSOR (U6.16)
BFA: IBVG-DRIVER (R69.1 U8.1 U8.16), PROCESSOR (U6.8)
BLANK: CT9042 Toplevel (JZ.1), SWEEP (R149.2)
DRIVE: POWERAMP (U30.2), SWEEP (U16.6)
IB1: IBVG-DRIVER (R77.1), PROCESSOR (U6.6)
IB2: IBVG-DRIVER (R72.1), PROCESSOR (U6.7)
IBPOL: IBVG-DRIVER (U206.10), PROCESSOR (U6.9)
LCD-D4: FrontPanel (J2.11), PROCESSOR (U?#9.34)
LCD-D5: FrontPanel (J2.13), PROCESSOR (U?#9.35)
LCD-D6: FrontPanel (J2.15), PROCESSOR (U?#9.36)
LCD-D7: FrontPanel (J2.17), PROCESSOR (U?#9.37)
LCD-E: FrontPanel (J2.9), PROCESSOR (U?#9.38)
LCD-RS: FrontPanel (J2.5), PROCESSOR (U?#9.40)
LCD-RW: FrontPanel (J2.7), PROCESSOR (U?#9.39)
MARKER: MULTIPLIER (U?#8.6), PROCESSOR (U?#9.31)
MARKERENABLE: MULTIPLIER (U?#8.5), PROCESSOR (U?#9.32)
OVERLOAD: SWEEP (U1002.9), MULTIPLIER (D?#2.1 D?#3.1 R?#4.1)
PMB: MULTIPLIER (U13.10), PROCESSOR (U6.5)
ROTPHA: FrontPanel (J2.16), PROCESSOR (U?#9.8)
ROTPHB: FrontPanel (J2.18), PROCESSOR (U?#9.9)
SCL: SWEEP (R154.2 U16.2), MULTIPLIER (U23.2), FrontPanel (J2.4), PROCESSOR (U6.22 U?#9.47)
SDA: SWEEP (R155.2 U16.3), MULTIPLIER (U23.3), FrontPanel (J2.6), PROCESSOR (U6.23 U?#9.46)
SWEEPSTART: SWEEP (U1002.11 U1002.12), PROCESSOR (U?#9.6)
XOUT: CT9042 Toplevel (JX.1), SWEEP (R31.2)
YOUT: CT9042 Toplevel (JY.1), MULTIPLIER (R118.2)